# EAGLE schematic RFBoard (EAGLE 9.3.1)

## Sheet 1 of 8
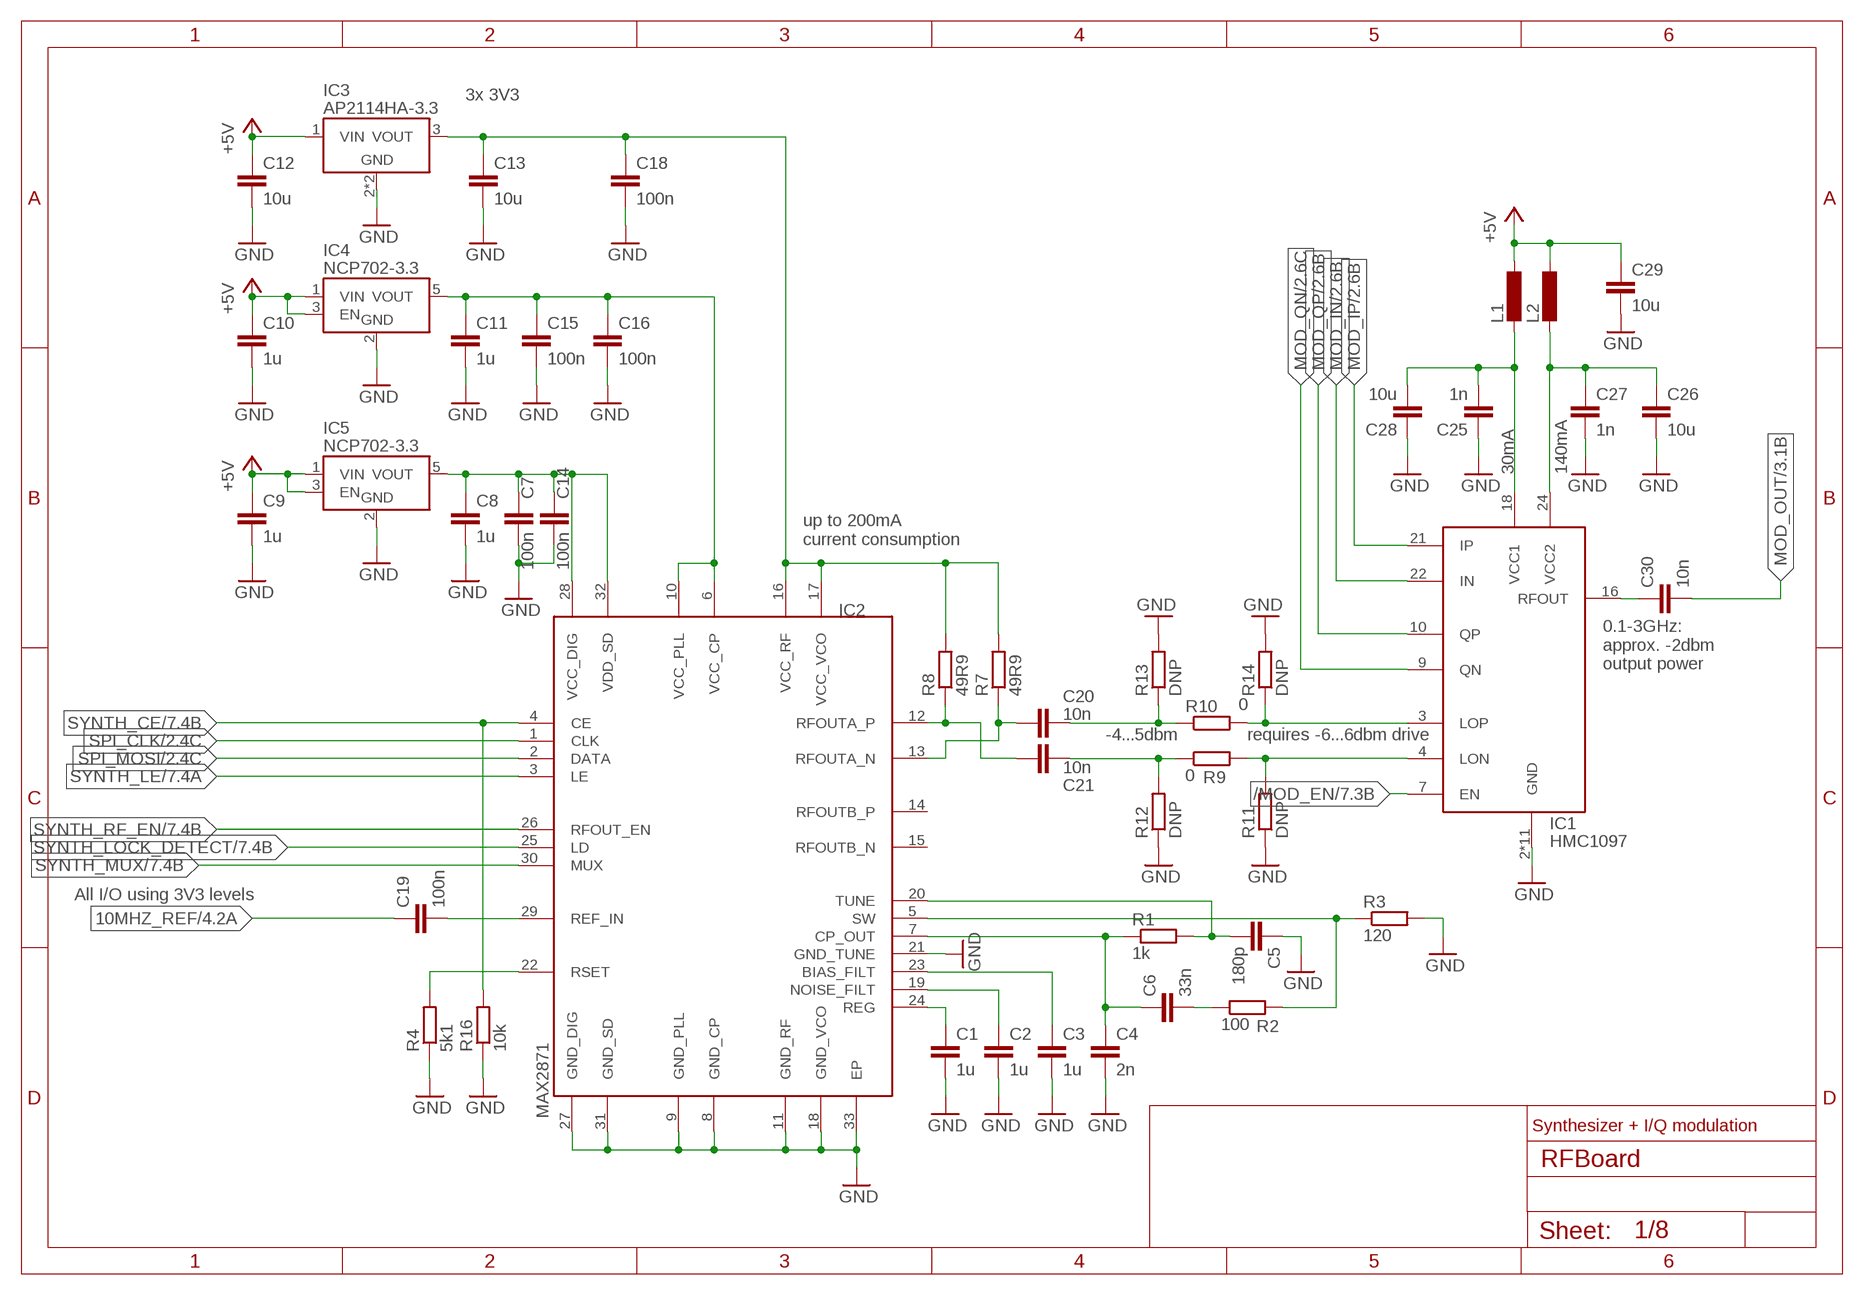
[diagram p0: schematic, sheet 1]

### Parts
C1  1u  C-EUC0603  [C0603]
C2  1u  C-EUC0603  [C0603]
C3  1u  C-EUC0603  [C0603]
C4  2n  C-EUC0603  [C0603]
C5  180p  C-EUC0603  [C0603]
C6  33n  C-EUC0603  [C0603]
C7  100n  C-EUC0603  [C0603]
C8  1u  C-EUC0603  [C0603]
C9  1u  C-EUC0603  [C0603]
C10  1u  C-EUC0603  [C0603]
C11  1u  C-EUC0603  [C0603]
C12  10u  C-EUC1206  [C1206]
C13  10u  C-EUC1206  [C1206]
C14  100n  C-EUC0603  [C0603]
C15  100n  C-EUC0603  [C0603]
C16  100n  C-EUC0603  [C0603]
C18  100n  C-EUC0603  [C0603]
C19  100n  C-EUC0603  [C0603]
C20  10n  C-EUC0603  [C0603]
C21  10n  C-EUC0603  [C0603]
C25  1n  C-EUC0603  [C0603]
C26  10u  C-EUC1206  [C1206]
C27  1n  C-EUC0603  [C0603]
C28  10u  C-EUC1206  [C1206]
C29  10u  C-EUC1206  [C1206]
C30  10n  C-EUC0603  [C0603]
IC1  HMC1097  [QFN50P400X400X100-25T280]
IC2  MAX2871  [QFN50P500X500X80-33T310]
IC3  AP2114HA-3.3  AP2114HA  [SOT230P700X180-4]
IC4  NCP702-3.3  NCP702  [SOT95P240X110-5]
IC5  NCP702-3.3  NCP702  [SOT95P240X110-5]
L1  L-EUL2012C  [L2012C]
L2  L-EUL2012C  [L2012C]
R1  1k  R-EU_R0603  [R0603]
R2  100  R-EU_R0603  [R0603]
R3  120  R-EU_R0603  [R0603]
R4  5k1  R-EU_R0603  [R0603]
R7  49R9  R-EU_R0603  [R0603]
R8  49R9  R-EU_R0603  [R0603]
R9  0  R-EU_R0603  [R0603]
R10  0  R-EU_R0603  [R0603]
R11  DNP  R-EU_R0603  [R0603]
R12  DNP  R-EU_R0603  [R0603]
R13  DNP  R-EU_R0603  [R0603]
R14  DNP  R-EU_R0603  [R0603]
R16  10k  R-EU_R0603  [R0603]

### Nets
10MHZ_REF: C19.1 ; also sheet 4,7
+5V: C9.1 C10.1 C12.1 C29.1 IC3.1(VIN) IC4.1(VIN) IC4.3(EN) IC5.1(VIN) IC5.3(EN) L1.1 L2.1 ; also sheet 2,3,4,5,6,7
/MOD_EN: IC1.7(EN) ; also sheet 7
GND: C1.2 C2.2 C3.2 C4.2 C5.1 C7.2 C8.2 C9.2 C10.2 C11.2 C12.2 C13.2 C14.2 C15.2 C16.2 C18.2 C25.1 C26.2 C27.2 C28.1 C29.2 IC1.2(GND) IC1.5(GND) IC1.8(GND) IC1.11(GND) IC1.12(GND) IC1.14(GND) IC1.17(GND) IC1.19(GND) IC1.20(GND) IC1.23(GND) IC1.25(GND) IC2.8(GND_CP) IC2.9(GND_PLL) IC2.11(GND_RF) IC2.18(GND_VCO) IC2.21(GND_TUNE) IC2.27(GND_DIG) IC2.31(GND_SD) IC2.33(EP) IC3.2(GND) IC3.4(GND) IC4.2(GND) IC5.2(GND) R3.2 R4.1 R11.1 R12.1 R13.2 R14.2 R16.1 ; also sheet 2,3,4,5,6,7,8
MOD_IN: IC1.22(IN) ; also sheet 2
MOD_IP: IC1.21(IP) ; also sheet 2
MOD_OUT: C30.2 ; also sheet 3
MOD_QN: IC1.9(QN) ; also sheet 2
MOD_QP: IC1.10(QP) ; also sheet 2
N$1: C5.2 IC2.20(TUNE) R1.2
N$2: C4.1 C6.1 IC2.7(CP_OUT) R1.1
N$3: C1.1 IC2.24(REG)
N$4: C2.1 IC2.19(NOISE_FILT)
N$5: C3.1 IC2.23(BIAS_FILT)
N$6: C6.2 R2.1
N$7: IC2.5(SW) R2.2 R3.1
N$8: IC2.22(RSET) R4.2
N$9: C19.2 IC2.29(REF_IN)
N$10: C13.1 C18.1 IC2.16(VCC_RF) IC2.17(VCC_VCO) IC3.3(VOUT) R7.2 R8.2
N$11: C11.1 C15.1 C16.1 IC2.6(VCC_CP) IC2.10(VCC_PLL) IC4.5(VOUT)
N$12: C20.1 IC2.13(RFOUTA_N) R7.1
N$13: C7.1 C8.1 C14.1 IC2.28(VCC_DIG) IC2.32(VDD_SD) IC5.5(VOUT)
N$14: C21.1 IC2.12(RFOUTA_P) R8.1
N$15: C20.2 R10.1 R13.1
N$16: C21.2 R9.1 R12.2
N$17: IC1.3(LOP) R10.2 R14.1
N$18: IC1.4(LON) R9.2 R11.2
N$20: C30.1 IC1.16(RFOUT)
SPI_CLK: IC2.1(CLK) ; also sheet 2,4,5,7
SPI_MOSI: IC2.2(DATA) ; also sheet 2,4,5,7
SYNTH_CE: IC2.4(CE) R16.2 ; also sheet 7
SYNTH_LE: IC2.3(LE) ; also sheet 7
SYNTH_LOCK_DETECT: IC2.25(LD) ; also sheet 7
SYNTH_MUX: IC2.30(MUX) ; also sheet 7
SYNTH_RF_EN: IC2.26(RFOUT_EN) ; also sheet 7
VDD: C25.2 C28.2 IC1.18(VCC1) L1.2
VDD1: C26.1 C27.1 IC1.24(VCC2) L2.2
Unconnected: IC2.14(RFOUTB_P) IC2.15(RFOUTB_N)

### Notes on the sheet
- 3x 3V3
- 30mA | 140mA
- up to 200mA
  current consumption
- 0.1-3GHz:
  approx. -2dbm
  output power
- -4...5dbm | requires -6...6dbm drive
- All I/O using 3V3 levels
- Synthesizer + I/Q modulation

## Sheet 2 of 8
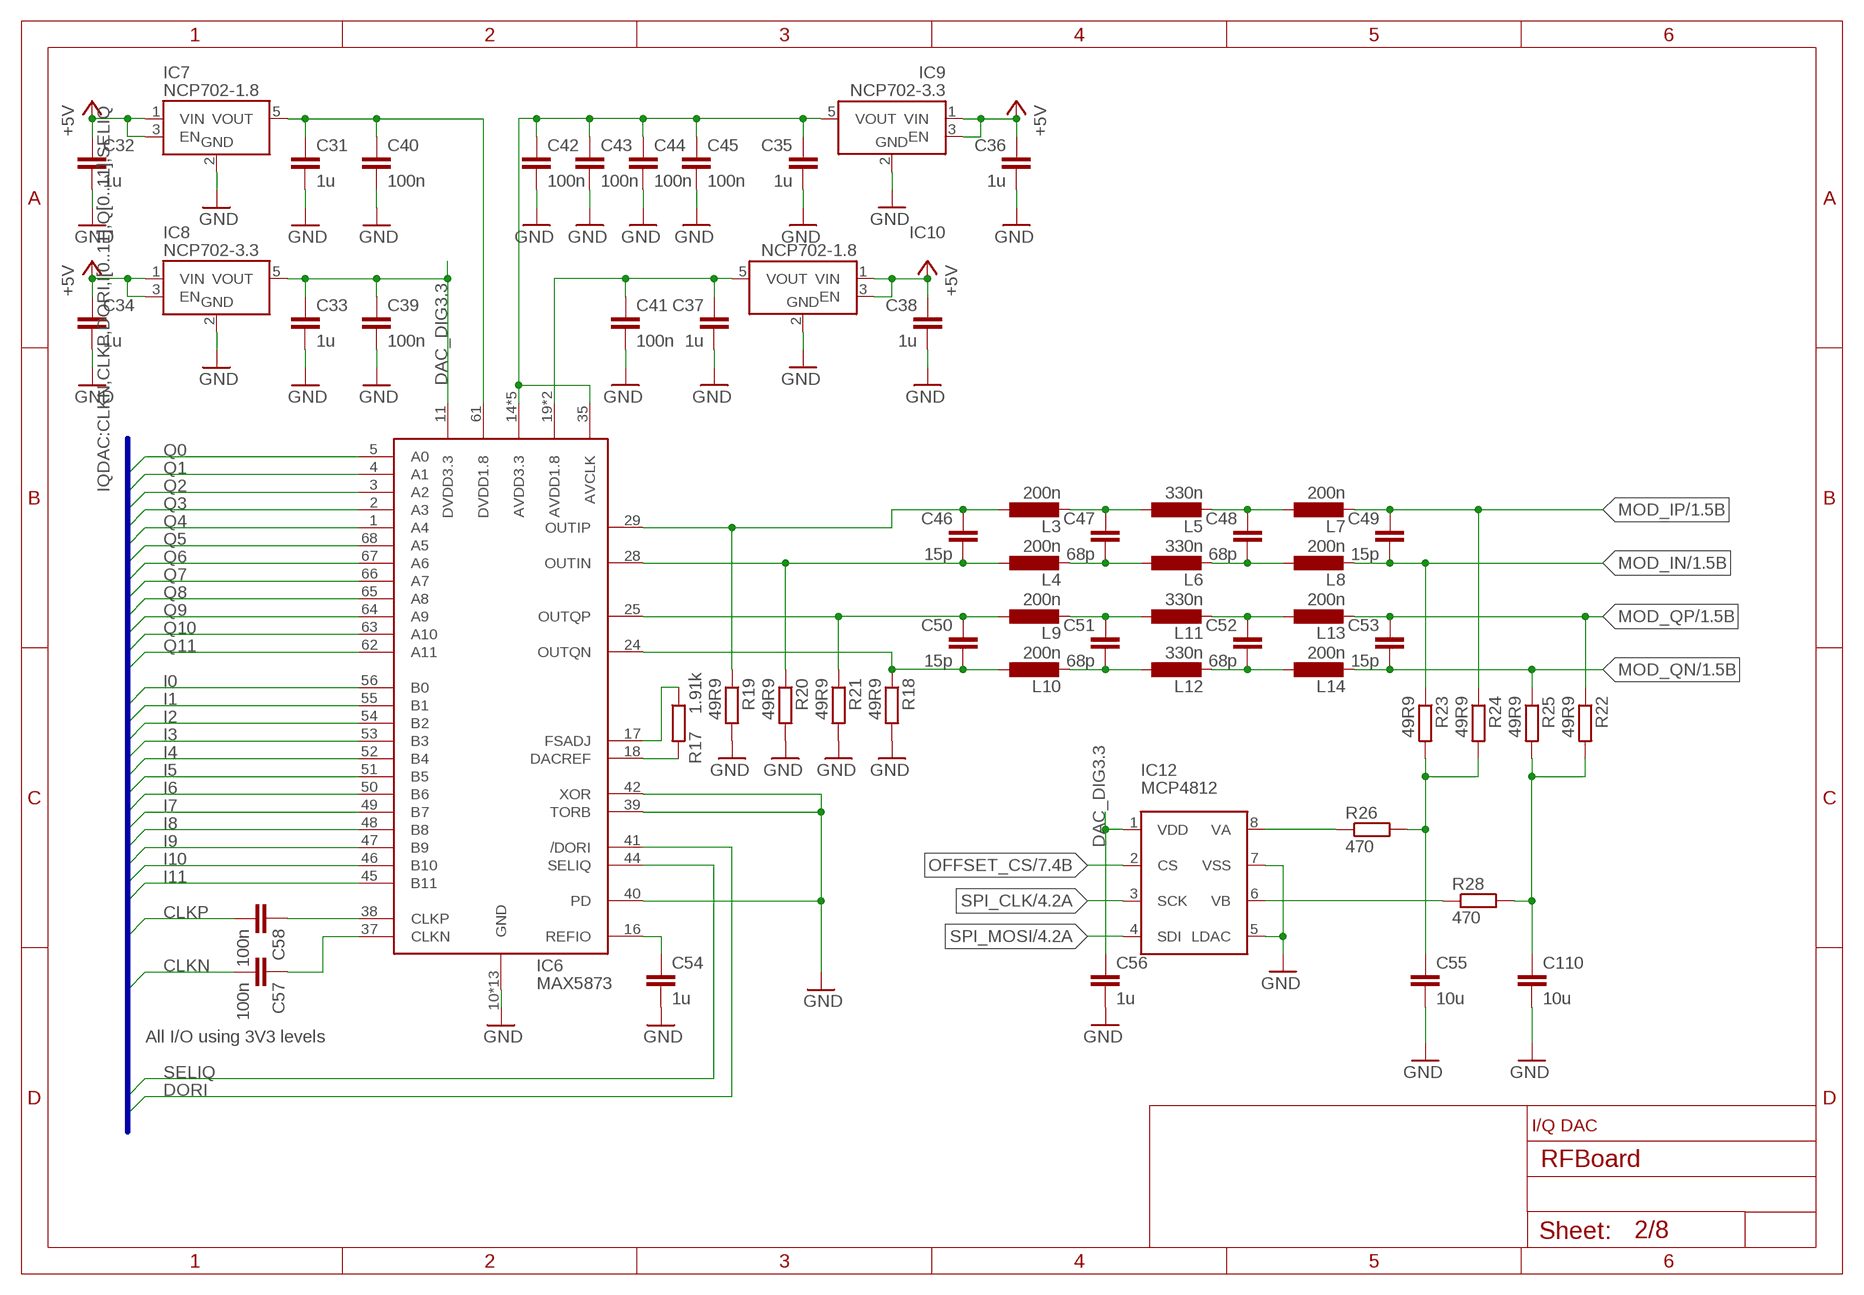
[diagram p1: schematic, sheet 2]

### Parts
C31  1u  C-EUC0603  [C0603]
C32  1u  C-EUC0603  [C0603]
C33  1u  C-EUC0603  [C0603]
C34  1u  C-EUC0603  [C0603]
C35  1u  C-EUC0603  [C0603]
C36  1u  C-EUC0603  [C0603]
C37  1u  C-EUC0603  [C0603]
C38  1u  C-EUC0603  [C0603]
C39  100n  C-EUC0603  [C0603]
C40  100n  C-EUC0603  [C0603]
C41  100n  C-EUC0603  [C0603]
C42  100n  C-EUC0603  [C0603]
C43  100n  C-EUC0603  [C0603]
C44  100n  C-EUC0603  [C0603]
C45  100n  C-EUC0603  [C0603]
C46  15p  C-EUC0603  [C0603]
C47  68p  C-EUC0603  [C0603]
C48  68p  C-EUC0603  [C0603]
C49  15p  C-EUC0603  [C0603]
C50  15p  C-EUC0603  [C0603]
C51  68p  C-EUC0603  [C0603]
C52  68p  C-EUC0603  [C0603]
C53  15p  C-EUC0603  [C0603]
C54  1u  C-EUC0603  [C0603]
C55  10u  C-EUC0603  [C0603]
C56  1u  C-EUC0603  [C0603]
C57  100n  C-EUC0603  [C0603]
C58  100n  C-EUC0603  [C0603]
C110  10u  C-EUC0603  [C0603]
IC6  MAX5873  [QFN50P1000X1000X100-69T770]
IC7  NCP702-1.8  NCP702  [SOT95P240X110-5]
IC8  NCP702-3.3  NCP702  [SOT95P240X110-5]
IC9  NCP702-3.3  NCP702  [SOT95P240X110-5]
IC10  NCP702-1.8  NCP702  [SOT95P240X110-5]
IC12  MCP4812  [SO08]
L3  200n  INDUCTOR0603  [R0603]
L4  200n  INDUCTOR0603  [R0603]
L5  330n  INDUCTOR0603  [R0603]
L6  330n  INDUCTOR0603  [R0603]
L7  200n  INDUCTOR0603  [R0603]
L8  200n  INDUCTOR0603  [R0603]
L9  200n  INDUCTOR0603  [R0603]
L10  200n  INDUCTOR0603  [R0603]
L11  330n  INDUCTOR0603  [R0603]
L12  330n  INDUCTOR0603  [R0603]
L13  200n  INDUCTOR0603  [R0603]
L14  200n  INDUCTOR0603  [R0603]
R17  1.91k  R-EU_R0603  [R0603]
R18  49R9  R-EU_R0603  [R0603]
R19  49R9  R-EU_R0603  [R0603]
R20  49R9  R-EU_R0603  [R0603]
R21  49R9  R-EU_R0603  [R0603]
R22  49R9  R-EU_R0603  [R0603]
R23  49R9  R-EU_R0603  [R0603]
R24  49R9  R-EU_R0603  [R0603]
R25  49R9  R-EU_R0603  [R0603]
R26  470  R-EU_R0603  [R0603]
R28  470  R-EU_R0603  [R0603]

### Nets
+5V: C32.1 C34.1 C36.1 C38.1 IC7.1(VIN) IC7.3(EN) IC8.1(VIN) IC8.3(EN) IC9.1(VIN) IC9.3(EN) IC10.1(VIN) IC10.3(EN) ; also sheet 1,3,4,5,6,7
CLKN: C57.2 ; also sheet 7
CLKP: C58.2 ; also sheet 7
DAC_DIG3.3: C33.1 C39.1 C56.1 IC6.11(DVDD3.3) IC8.5(VOUT) IC12.1(VDD)
DORI: IC6.41(/DORI) ; also sheet 7
GND: C31.2 C32.2 C33.2 C34.2 C35.2 C36.2 C37.2 C38.2 C39.2 C40.2 C41.2 C42.2 C43.2 C44.2 C45.2 C54.2 C55.2 C56.2 C110.2 IC6.10(GND) IC6.12(GND) IC6.13(GND) IC6.15(GND) IC6.20(GND) IC6.23(GND) IC6.26(GND) IC6.27(GND) IC6.30(GND) IC6.33(GND) IC6.36(GND) IC6.39(TORB) IC6.40(PD) IC6.42(XOR) IC6.43(GND) IC6.69(GND) IC7.2(GND) IC8.2(GND) IC9.2(GND) IC10.2(GND) IC12.5(LDAC) IC12.7(VSS) R18.2 R19.2 R20.2 R21.2 ; also sheet 1,3,4,5,6,7,8
I0: IC6.56(B0) ; also sheet 7
I1: IC6.55(B1) ; also sheet 7
I2: IC6.54(B2) ; also sheet 7
I3: IC6.53(B3) ; also sheet 7
I4: IC6.52(B4) ; also sheet 7
I5: IC6.51(B5) ; also sheet 7
I6: IC6.50(B6) ; also sheet 7
I7: IC6.49(B7) ; also sheet 7
I8: IC6.48(B8) ; also sheet 7
I9: IC6.47(B9) ; also sheet 7
I10: IC6.46(B10) ; also sheet 7
I11: IC6.45(B11) ; also sheet 7
MOD_IN: C49.2 L8.2 R23.1 ; also sheet 1
MOD_IP: C49.1 L7.2 R24.1 ; also sheet 1
MOD_QN: C53.2 L14.2 R25.1 ; also sheet 1
MOD_QP: C53.1 L13.2 R22.1 ; also sheet 1
N$22: C31.1 C40.1 IC6.61(DVDD1.8) IC7.5(VOUT)
N$23: C58.1 IC6.38(CLKP)
N$25: C35.1 C42.1 C43.1 C44.1 C45.1 IC6.14(AVDD3.3) IC6.21(AVDD3.3) IC6.22(AVDD3.3) IC6.31(AVDD3.3) IC6.32(AVDD3.3) IC6.35(AVCLK) IC9.5(VOUT)
N$26: C37.1 C41.1 IC6.19(AVDD1.8) IC6.34(AVDD1.8) IC10.5(VOUT)
N$27: IC6.18(DACREF) R17.2
N$28: IC6.17(FSADJ) R17.1
N$29: C55.1 R23.2 R24.2 R26.2
N$30: C110.1 R22.2 R25.2 R28.2
N$31: C46.2 IC6.28(OUTIN) L4.1 R20.1
N$32: C46.1 IC6.29(OUTIP) L3.1 R19.1
N$33: C47.2 L4.2 L6.1
N$34: C48.2 L6.2 L8.1
N$35: C47.1 L3.2 L5.1
N$36: C48.1 L5.2 L7.1
N$37: C54.1 IC6.16(REFIO)
N$38: IC12.8(VA) R26.1
N$39: C50.2 IC6.24(OUTQN) L10.1 R18.1
N$40: C50.1 IC6.25(OUTQP) L9.1 R21.1
N$41: C51.2 L10.2 L12.1
N$42: C52.2 L12.2 L14.1
N$43: C51.1 L9.2 L11.1
N$44: C52.1 L11.2 L13.1
N$45: C57.1 IC6.37(CLKN)
N$103: IC12.6(VB) R28.1
OFFSET_CS: IC12.2(CS) ; also sheet 7
Q0: IC6.5(A0) ; also sheet 7
Q1: IC6.4(A1) ; also sheet 7
Q2: IC6.3(A2) ; also sheet 7
Q3: IC6.2(A3) ; also sheet 7
Q4: IC6.1(A4) ; also sheet 7
Q5: IC6.68(A5) ; also sheet 7
Q6: IC6.67(A6) ; also sheet 7
Q7: IC6.66(A7) ; also sheet 7
Q8: IC6.65(A8) ; also sheet 7
Q9: IC6.64(A9) ; also sheet 7
Q10: IC6.63(A10) ; also sheet 7
Q11: IC6.62(A11) ; also sheet 7
SELIQ: IC6.44(SELIQ) ; also sheet 7
SPI_CLK: IC12.3(SCK) ; also sheet 1,4,5,7
SPI_MOSI: IC12.4(SDI) ; also sheet 1,4,5,7

### Buses
IQDAC:CLKN,CLKP,DORI,I[0..11],Q[0..11],SELIQ

### Notes on the sheet
- All I/O using 3V3 levels
- I/Q DAC

## Sheet 3 of 8
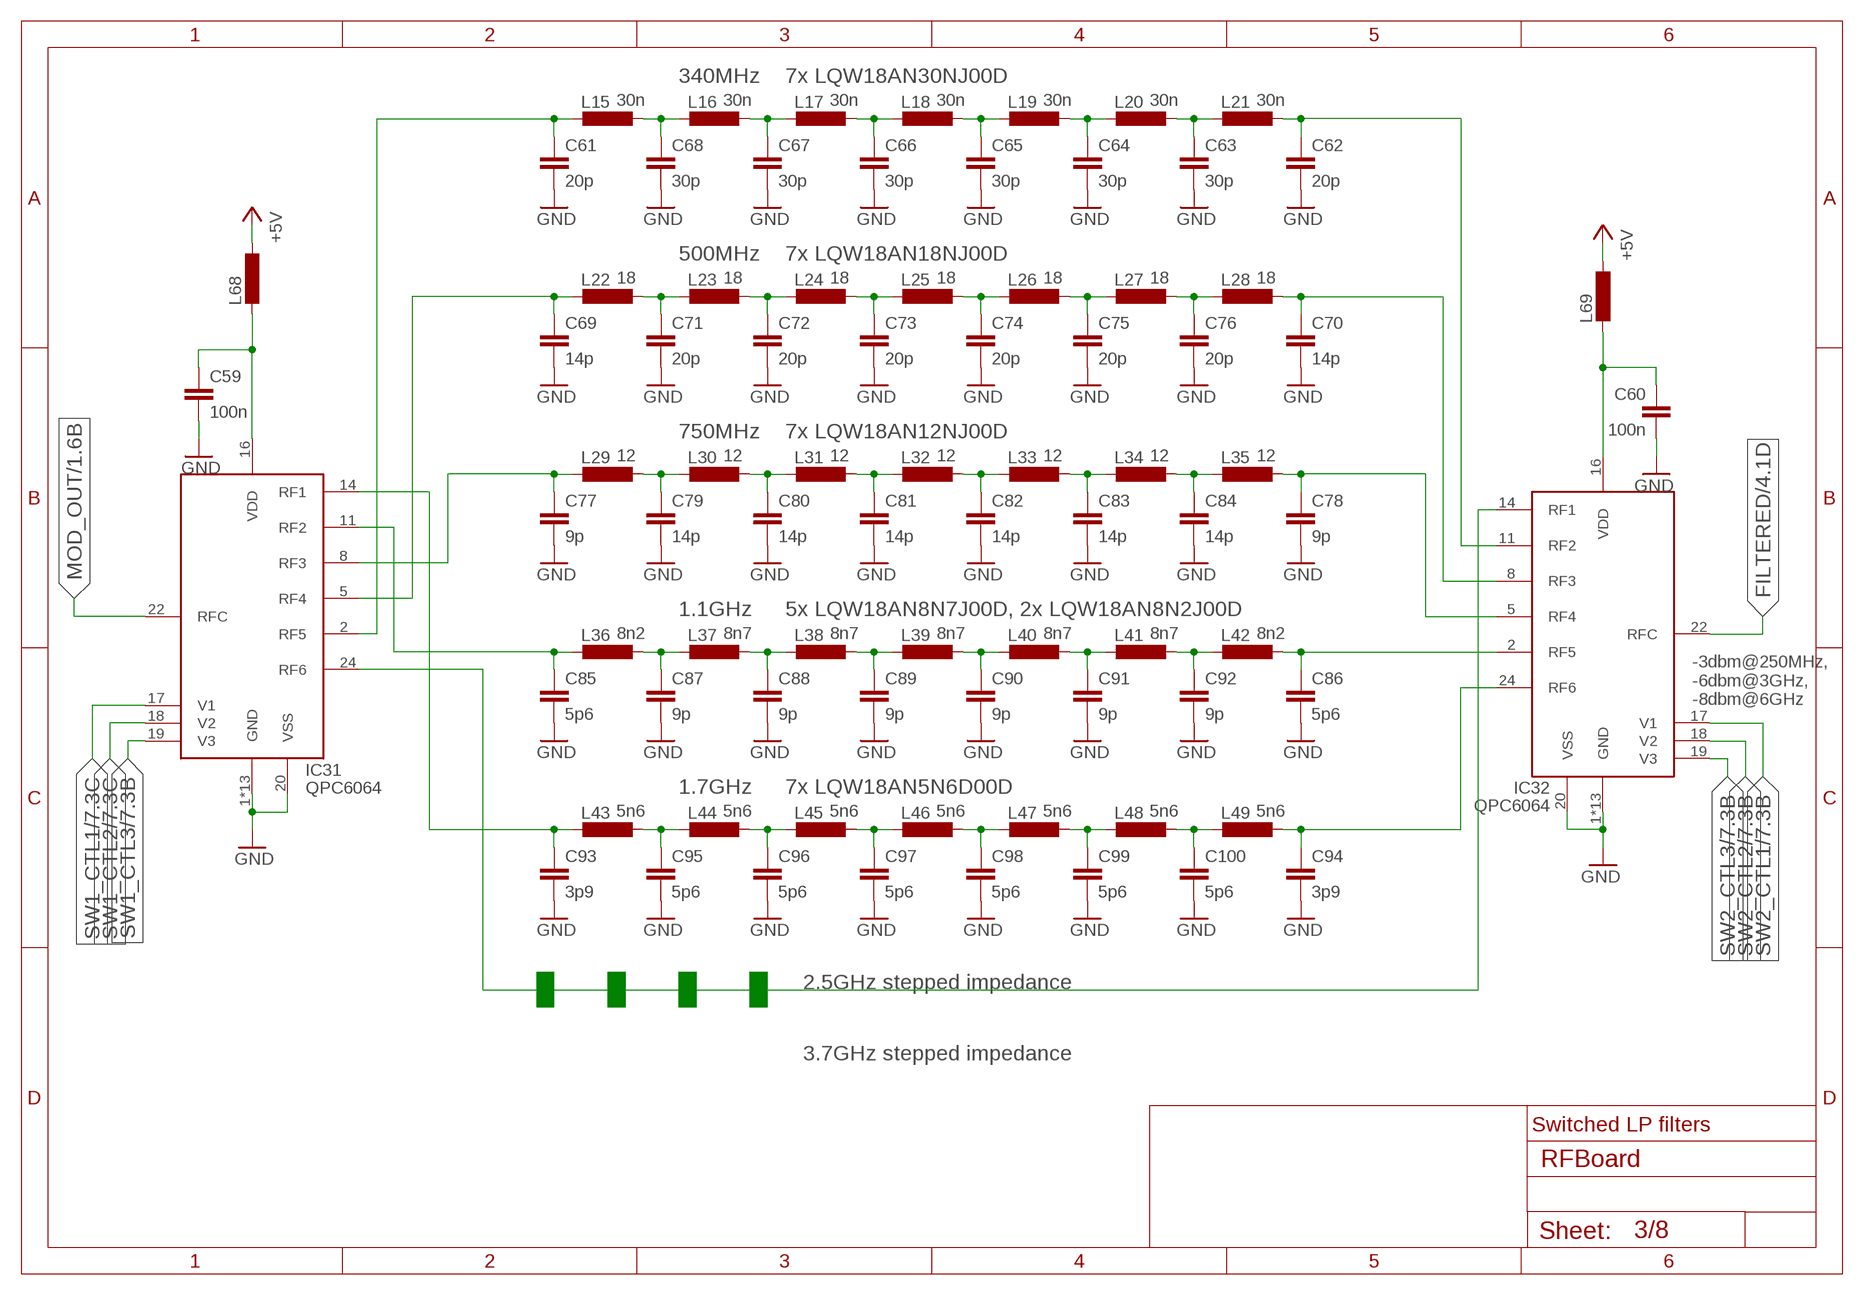
[diagram p2: schematic, sheet 3]

### Parts
C59  100n  C-EUC0603  [C0603]
C60  100n  C-EUC0603  [C0603]
C61  20p  C-EUC0603  [C0603]
C62  20p  C-EUC0603  [C0603]
C63  30p  C-EUC0603  [C0603]
C64  30p  C-EUC0603  [C0603]
C65  30p  C-EUC0603  [C0603]
C66  30p  C-EUC0603  [C0603]
C67  30p  C-EUC0603  [C0603]
C68  30p  C-EUC0603  [C0603]
C69  14p  C-EUC0603  [C0603]
C70  14p  C-EUC0603  [C0603]
C71  20p  C-EUC0603  [C0603]
C72  20p  C-EUC0603  [C0603]
C73  20p  C-EUC0603  [C0603]
C74  20p  C-EUC0603  [C0603]
C75  20p  C-EUC0603  [C0603]
C76  20p  C-EUC0603  [C0603]
C77  9p  C-EUC0603  [C0603]
C78  9p  C-EUC0603  [C0603]
C79  14p  C-EUC0603  [C0603]
C80  14p  C-EUC0603  [C0603]
C81  14p  C-EUC0603  [C0603]
C82  14p  C-EUC0603  [C0603]
C83  14p  C-EUC0603  [C0603]
C84  14p  C-EUC0603  [C0603]
C85  5p6  C-EUC0603  [C0603]
C86  5p6  C-EUC0603  [C0603]
C87  9p  C-EUC0603  [C0603]
C88  9p  C-EUC0603  [C0603]
C89  9p  C-EUC0603  [C0603]
C90  9p  C-EUC0603  [C0603]
C91  9p  C-EUC0603  [C0603]
C92  9p  C-EUC0603  [C0603]
C93  3p9  C-EUC0603  [C0603]
C94  3p9  C-EUC0603  [C0603]
C95  5p6  C-EUC0603  [C0603]
C96  5p6  C-EUC0603  [C0603]
C97  5p6  C-EUC0603  [C0603]
C98  5p6  C-EUC0603  [C0603]
C99  5p6  C-EUC0603  [C0603]
C100  5p6  C-EUC0603  [C0603]
IC31  QPC6064  [QFN50P400X400X75-25T270]
IC32  QPC6064  [QFN50P400X400X75-25T270]
L15  30n  INDUCTOR0603  [R0603]
L16  30n  INDUCTOR0603  [R0603]
L17  30n  INDUCTOR0603  [R0603]
L18  30n  INDUCTOR0603  [R0603]
L19  30n  INDUCTOR0603  [R0603]
L20  30n  INDUCTOR0603  [R0603]
L21  30n  INDUCTOR0603  [R0603]
L22  18  INDUCTOR0603  [R0603]
L23  18  INDUCTOR0603  [R0603]
L24  18  INDUCTOR0603  [R0603]
L25  18  INDUCTOR0603  [R0603]
L26  18  INDUCTOR0603  [R0603]
L27  18  INDUCTOR0603  [R0603]
L28  18  INDUCTOR0603  [R0603]
L29  12  INDUCTOR0603  [R0603]
L30  12  INDUCTOR0603  [R0603]
L31  12  INDUCTOR0603  [R0603]
L32  12  INDUCTOR0603  [R0603]
L33  12  INDUCTOR0603  [R0603]
L34  12  INDUCTOR0603  [R0603]
L35  12  INDUCTOR0603  [R0603]
L36  8n2  INDUCTOR0603  [R0603]
L37  8n7  INDUCTOR0603  [R0603]
L38  8n7  INDUCTOR0603  [R0603]
L39  8n7  INDUCTOR0603  [R0603]
L40  8n7  INDUCTOR0603  [R0603]
L41  8n7  INDUCTOR0603  [R0603]
L42  8n2  INDUCTOR0603  [R0603]
L43  5n6  INDUCTOR0603  [R0603]
L44  5n6  INDUCTOR0603  [R0603]
L45  5n6  INDUCTOR0603  [R0603]
L46  5n6  INDUCTOR0603  [R0603]
L47  5n6  INDUCTOR0603  [R0603]
L48  5n6  INDUCTOR0603  [R0603]
L49  5n6  INDUCTOR0603  [R0603]
L68  L-EUL2012C  [L2012C]
L69  L-EUL2012C  [L2012C]

### Nets
+5V: L68.1 L69.1 ; also sheet 1,2,4,5,6,7
FILTERED: IC32.22(RFC) ; also sheet 4
GND: C59.2 C60.2 C61.2 C62.2 C63.2 C64.2 C65.2 C66.2 C67.2 C68.2 C69.2 C70.2 C71.2 C72.2 C73.2 C74.2 C75.2 C76.2 C77.2 C78.2 C79.2 C80.2 C81.2 C82.2 C83.2 C84.2 C85.2 C86.2 C87.2 C88.2 C89.2 C90.2 C91.2 C92.2 C93.2 C94.2 C95.2 C96.2 C97.2 C98.2 C99.2 C100.2 IC31.1(GND) IC31.3(GND) IC31.4(GND) IC31.6(GND) IC31.7(GND) IC31.9(GND) IC31.10(GND) IC31.12(GND) IC31.13(GND) IC31.15(GND) IC31.20(VSS) IC31.21(GND) IC31.23(GND) IC31.25(GND) IC32.1(GND) IC32.3(GND) IC32.4(GND) IC32.6(GND) IC32.7(GND) IC32.9(GND) IC32.10(GND) IC32.12(GND) IC32.13(GND) IC32.15(GND) IC32.20(VSS) IC32.21(GND) IC32.23(GND) IC32.25(GND) ; also sheet 1,2,4,5,6,7,8
MOD_OUT: IC31.22(RFC) ; also sheet 1
N$46: C68.1 L15.1 L16.2
N$47: C67.1 L16.1 L17.2
N$48: C66.1 L17.1 L18.2
N$49: C65.1 L18.1 L19.2
N$50: C64.1 L19.1 L20.2
N$51: C63.1 L20.1 L21.2
N$52: C61.1 IC31.2(RF5) L15.2
N$53: C62.1 IC32.11(RF2) L21.1
N$54: C71.1 L22.1 L23.2
N$55: C72.1 L23.1 L24.2
N$56: C73.1 L24.1 L25.2
N$57: C74.1 L25.1 L26.2
N$58: C75.1 L26.1 L27.2
N$59: C76.1 L27.1 L28.2
N$60: C69.1 IC31.5(RF4) L22.2
N$62: C79.1 L29.1 L30.2
N$63: C80.1 L30.1 L31.2
N$64: C81.1 L31.1 L32.2
N$65: C82.1 L32.1 L33.2
N$66: C83.1 L33.1 L34.2
N$67: C84.1 L34.1 L35.2
N$69: C78.1 IC32.5(RF4) L35.1
N$70: C87.1 L36.1 L37.2
N$71: C88.1 L37.1 L38.2
N$72: C89.1 L38.1 L39.2
N$73: C90.1 L39.1 L40.2
N$74: C91.1 L40.1 L41.2
N$75: C92.1 L41.1 L42.2
N$76: C85.1 IC31.11(RF2) L36.2
N$77: C86.1 IC32.2(RF5) L42.1
N$78: C95.1 L43.1 L44.2
N$79: C96.1 L44.1 L45.2
N$80: C97.1 L45.1 L46.2
N$81: C98.1 L46.1 L47.2
N$82: C99.1 L47.1 L48.2
N$83: C100.1 L48.1 L49.2
N$84: C93.1 IC31.14(RF1) L43.2
N$85: C94.1 IC32.24(RF6) L49.1
N$90: C77.1 IC31.8(RF3) L29.2
N$91: C70.1 IC32.8(RF3) L28.1
STEPPED25: IC31.24(RF6) IC32.14(RF1)
SW1_CTL1: IC31.17(V1) ; also sheet 7
SW1_CTL2: IC31.18(V2) ; also sheet 7
SW1_CTL3: IC31.19(V3) ; also sheet 7
SW2_CTL1: IC32.17(V1) ; also sheet 7
SW2_CTL2: IC32.18(V2) ; also sheet 7
SW2_CTL3: IC32.19(V3) ; also sheet 7
SWITCHES_VCC: C60.1 IC32.16(VDD) L69.2
VDD2: C59.1 IC31.16(VDD) L68.2

### Notes on the sheet
- 340MHz | 7x LQW18AN30NJ00D
- 500MHz | 7x LQW18AN18NJ00D
- 750MHz | 7x LQW18AN12NJ00D
- 1.1GHz | 5x LQW18AN8N7J00D, 2x LQW18AN8N2J00D
- -3dbm@250MHz,
  -6dbm@3GHz,
  -8dbm@6GHz
- 1.7GHz | 7x LQW18AN5N6D00D
- 2.5GHz stepped impedance
- 3.7GHz stepped impedance
- Switched LP filters

## Sheet 4 of 8
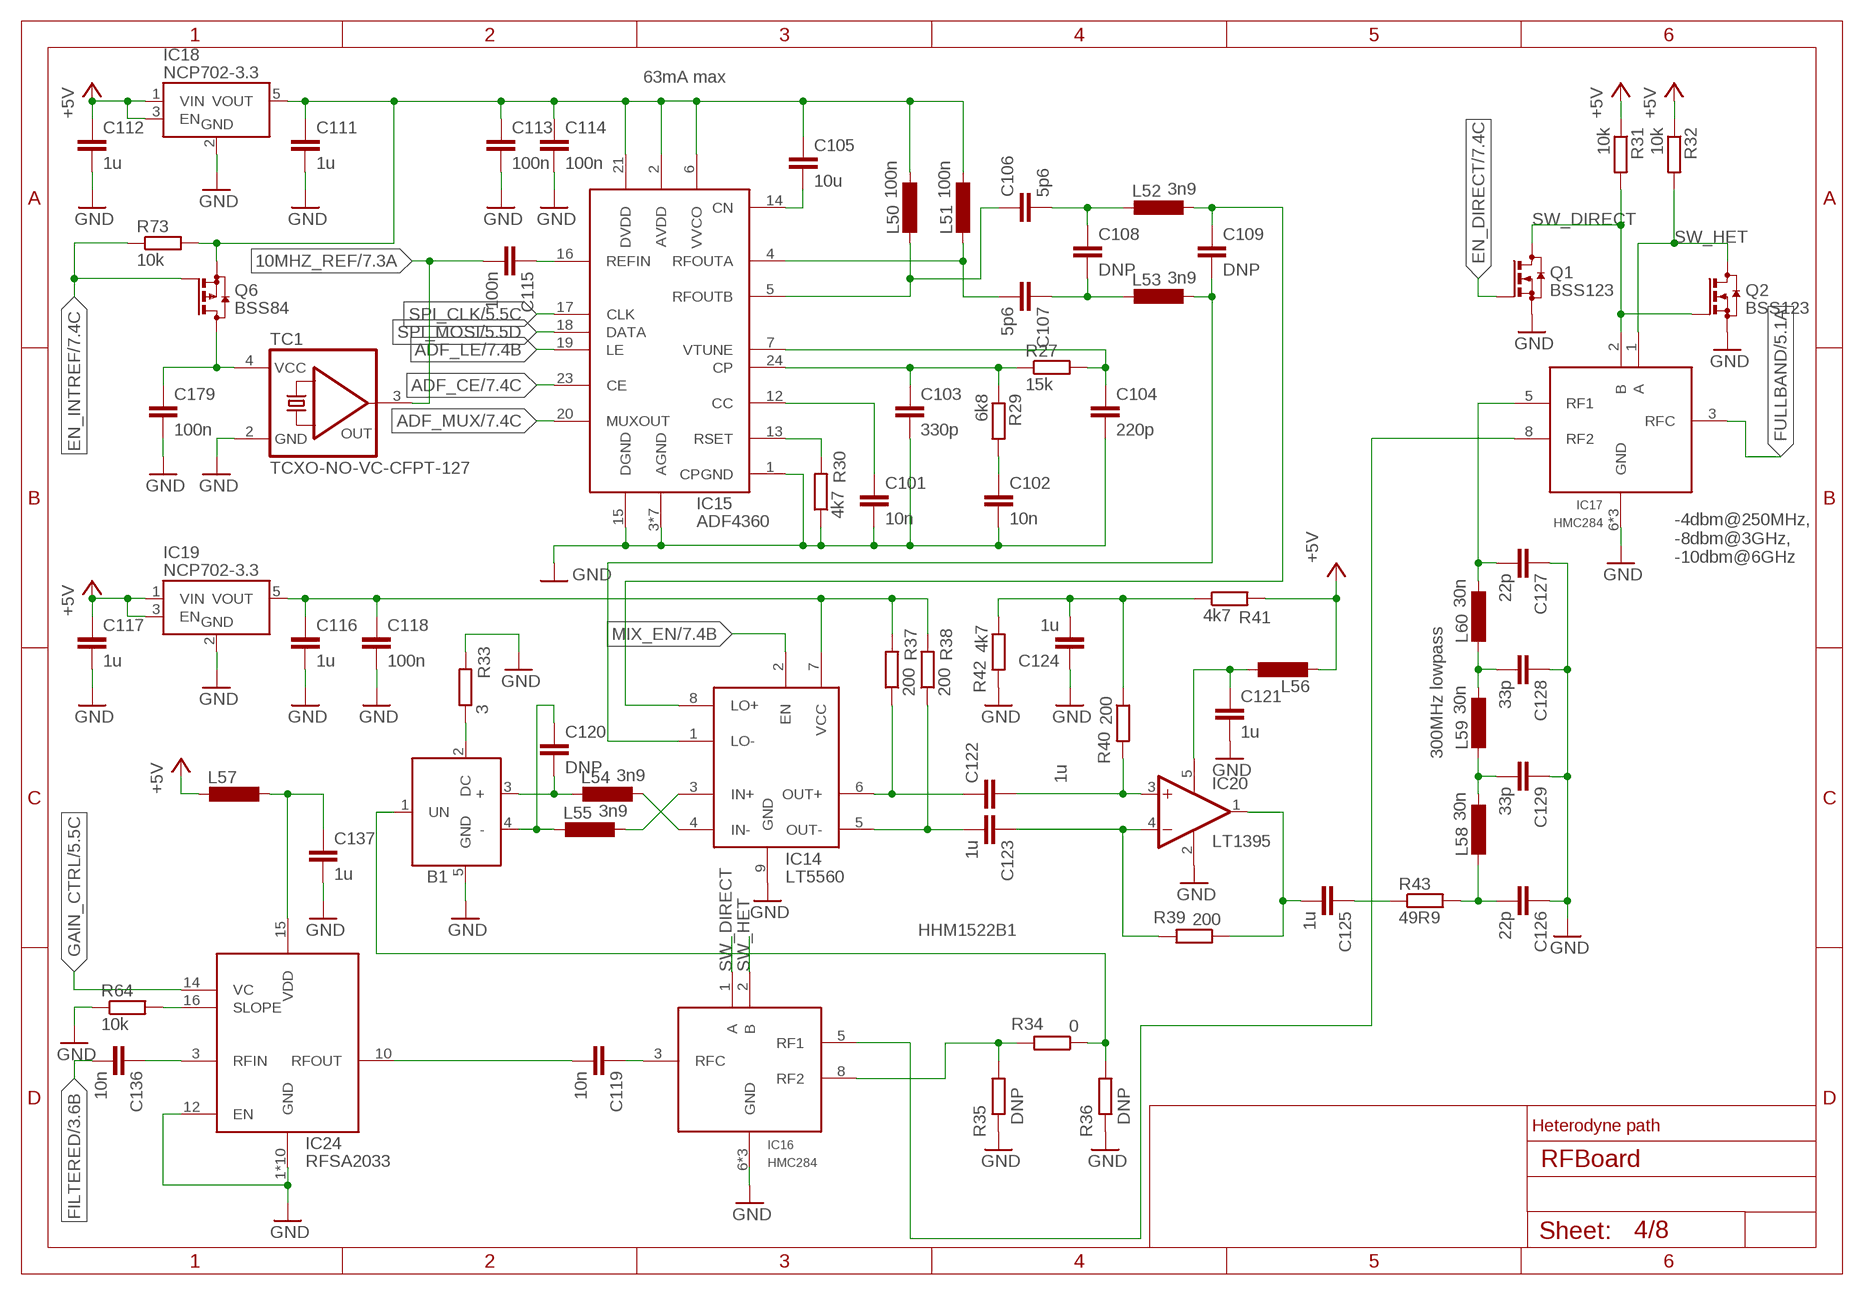
[diagram p3: schematic, sheet 4]

### Parts
B1  HHM1522B1  [INDCAF65P200X125X95-6]
C101  10n  C-EUC0603  [C0603]
C102  10n  C-EUC0603  [C0603]
C103  330p  C-EUC0603  [C0603]
C104  220p  C-EUC0603  [C0603]
C105  10u  C-EUC0603  [C0603]
C106  5p6  C-EUC0603  [C0603]
C107  5p6  C-EUC0603  [C0603]
C108  DNP  C-EUC0603  [C0603]
C109  DNP  C-EUC0603  [C0603]
C111  1u  C-EUC0603  [C0603]
C112  1u  C-EUC0603  [C0603]
C113  100n  C-EUC0603  [C0603]
C114  100n  C-EUC0603  [C0603]
C115  100n  C-EUC0603  [C0603]
C116  1u  C-EUC0603  [C0603]
C117  1u  C-EUC0603  [C0603]
C118  100n  C-EUC0603  [C0603]
C119  10n  C-EUC0603  [C0603]
C120  DNP  C-EUC0603  [C0603]
C121  1u  C-EUC0603  [C0603]
C122  1u  C-EUC0603  [C0603]
C123  1u  C-EUC0603  [C0603]
C124  1u  C-EUC0603  [C0603]
C125  1u  C-EUC0603  [C0603]
C126  22p  C-EUC0603  [C0603]
C127  22p  C-EUC0603  [C0603]
C128  33p  C-EUC0603  [C0603]
C129  33p  C-EUC0603  [C0603]
C136  10n  C-EUC0603  [C0603]
C137  1u  C-EUC0603  [C0603]
C179  100n  C-EUC0603  [C0603]
IC14  LT5560  [SON50P300X300X80-9T165X238]
IC15  ADF4360  [QFN50P400X400X80-25T230]
IC16  HMC284  [MSOP08]
IC17  HMC284  [MSOP08]
IC18  NCP702-3.3  NCP702  [SOT95P240X110-5]
IC19  NCP702-3.3  NCP702  [SOT95P240X110-5]
IC20  LT1395  OPA344N-SOT23  [SOT23-5]
IC24  RFSA2033  [QFN50P300X300X85-17T170]
L50  100n  INDUCTOR0603  [R0603]
L51  100n  INDUCTOR0603  [R0603]
L52  3n9  INDUCTOR0603  [R0603]
L53  3n9  INDUCTOR0603  [R0603]
L54  3n9  INDUCTOR0603  [R0603]
L55  3n9  INDUCTOR0603  [R0603]
L56  L-EUL2012C  [L2012C]
L57  L-EUL2012C  [L2012C]
L58  30n  INDUCTOR0603  [R0603]
L59  30n  INDUCTOR0603  [R0603]
L60  30n  INDUCTOR0603  [R0603]
Q1  BSS123  [SOT23]
Q2  BSS123  [SOT23]
Q6  BSS84  [SOT23]
R27  15k  R-EU_R0603  [R0603]
R29  6k8  R-EU_R0603  [R0603]
R30  4k7  R-EU_R0603  [R0603]
R31  10k  R-EU_R0603  [R0603]
R32  10k  R-EU_R0603  [R0603]
R33  3  R-EU_R0603  [R0603]
R34  0  R-EU_R0603  [R0603]
R35  DNP  R-EU_R0603  [R0603]
R36  DNP  R-EU_R0603  [R0603]
R37  200  R-EU_R0603  [R0603]
R38  200  R-EU_R0603  [R0603]
R39  200  R-EU_R0603  [R0603]
R40  200  R-EU_R0603  [R0603]
R41  4k7  R-EU_R0603  [R0603]
R42  4k7  R-EU_R0603  [R0603]
R43  49R9  R-EU_R0603  [R0603]
R64  10k  R-EU_R0603  [R0603]
R73  10k  R-EU_R0603  [R0603]
TC1  TCXO-NO-VC-CFPT-127  [5.0X3.2-TCXO]

### Nets
10MHZ_REF: C115.2 TC1.3(OUT) ; also sheet 1,7
+5V: C112.1 C117.1 IC18.1(VIN) IC18.3(EN) IC19.1(VIN) IC19.3(EN) L56.2 L57.2 R31.1 R32.1 R41.2 ; also sheet 1,2,3,5,6,7
ADF_CE: IC15.23(CE) ; also sheet 7
ADF_LE: IC15.19(LE) ; also sheet 7
ADF_MUX: IC15.20(MUXOUT) ; also sheet 7
DAC_DIG3.2: C116.1 C118.1 IC14.7(VCC) IC19.5(VOUT) R37.2 R38.2
EN_DIRECT: Q1.1(G) ; also sheet 7
EN_INTREF: Q6.1(G) R73.1 ; also sheet 7
FILTERED: C136.2 ; also sheet 3
FULLBAND: IC17.3(RFC) ; also sheet 5
GAIN_CTRL: IC24.14(VC) ; also sheet 5
GND: B1.5(GND) C101.2 C102.2 C103.2 C104.2 C111.2 C112.2 C113.2 C114.2 C116.2 C117.2 C118.2 C121.2 C124.1 C126.1 C127.1 C128.1 C129.1 C137.2 C179.2 IC14.9(GND) IC15.1(CPGND) IC15.3(AGND) IC15.8(AGND) IC15.9(AGND) IC15.10(AGND) IC15.11(AGND) IC15.15(DGND) IC15.22(AGND) IC15.25(AGND) IC16.6(GND) IC16.7(GND) IC16.9(GND) IC17.6(GND) IC17.7(GND) IC17.9(GND) IC18.2(GND) IC19.2(GND) IC20.2(V-) IC24.1(GND) IC24.2(GND) IC24.4(GND) IC24.5(GND) IC24.6(GND) IC24.7(GND) IC24.8(GND) IC24.9(GND) IC24.11(GND) IC24.12(EN) IC24.17(GND) Q1.2(S) Q2.2(S) R30.1 R33.2 R35.2 R36.2 R42.2 R64.1 TC1.2(GND) ; also sheet 1,2,3,5,6,7,8
MIX_EN: IC14.2(EN) ; also sheet 7
N$61: IC14.3(IN+) L55.1
N$68: IC14.4(IN-) L54.1
N$86: IC15.13(RSET) R30.2
N$87: C101.1 IC15.12(CC)
N$88: C102.1 R29.2
N$92: C103.1 IC15.24(CP) R27.1 R29.1
N$93: C104.1 IC15.7(VTUNE) R27.2
N$94: C115.1 IC15.16(REFIN)
N$95: C105.2 IC15.14(CN)
N$96: C106.1 IC15.5(RFOUTB) L50.2
N$97: C107.2 IC15.4(RFOUTA) L51.2
N$98: C106.2 C108.1 L52.2
N$99: C107.1 C108.2 L53.2
N$100: C109.1 IC14.8(LO+) L52.1
N$101: C109.2 IC14.1(LO-) L53.1
N$102: C119.1 IC16.3(RFC)
N$104: B1.3(+) C120.2 L54.2
N$107: B1.4(-) C120.1 L55.2
N$108: IC16.5(RF1) IC17.8(RF2)
N$109: IC16.8(RF2) R34.2 R35.1
N$110: B1.2(DC) R33.1
N$111: B1.1(UN) R34.1 R36.1
N$112: C121.1 IC20.5(V+) L56.1
N$113: C122.1 IC14.6(OUT+) R37.1
N$114: C123.2 IC14.5(OUT-) R38.1
N$115: C125.2 IC20.1(OUT) R39.1
N$116: C123.1 IC20.4(-IN) R39.2
N$117: C122.2 IC20.3(+IN) R40.2
N$118: C124.2 R40.1 R41.1 R42.1
N$119: C125.1 R43.1
N$120: C127.2 IC17.5(RF1) L60.1
N$121: C126.2 L58.2 R43.2
N$122: C129.2 L58.1 L59.2
N$123: C128.2 L59.1 L60.2
N$135: C119.2 IC24.10(RFOUT)
N$136: C136.1 IC24.3(RFIN)
N$137: C137.1 IC24.15(VDD) L57.1
N$164: IC24.16(SLOPE) R64.2
N$181: C179.1 Q6.3(D) TC1.4(VCC)
PLL_DIG3: C105.1 C111.1 C113.1 C114.1 IC15.2(AVDD) IC15.6(VVCO) IC15.21(DVDD) IC18.5(VOUT) L50.1 L51.1 Q6.2(S) R73.2
SPI_CLK: IC15.17(CLK) ; also sheet 1,2,5,7
SPI_MOSI: IC15.18(DATA) ; also sheet 1,2,5,7
SW_DIRECT: IC16.1(A) IC17.2(B) Q1.3(D) Q2.1(G) R31.2
SW_HET: IC16.2(B) IC17.1(A) Q2.3(D) R32.2

### Notes on the sheet
- 63mA max
- -4dbm@250MHz,
  -8dbm@3GHz,
  -10dbm@6GHz
- 300MHz lowpass
- Heterodyne path

## Sheet 5 of 8
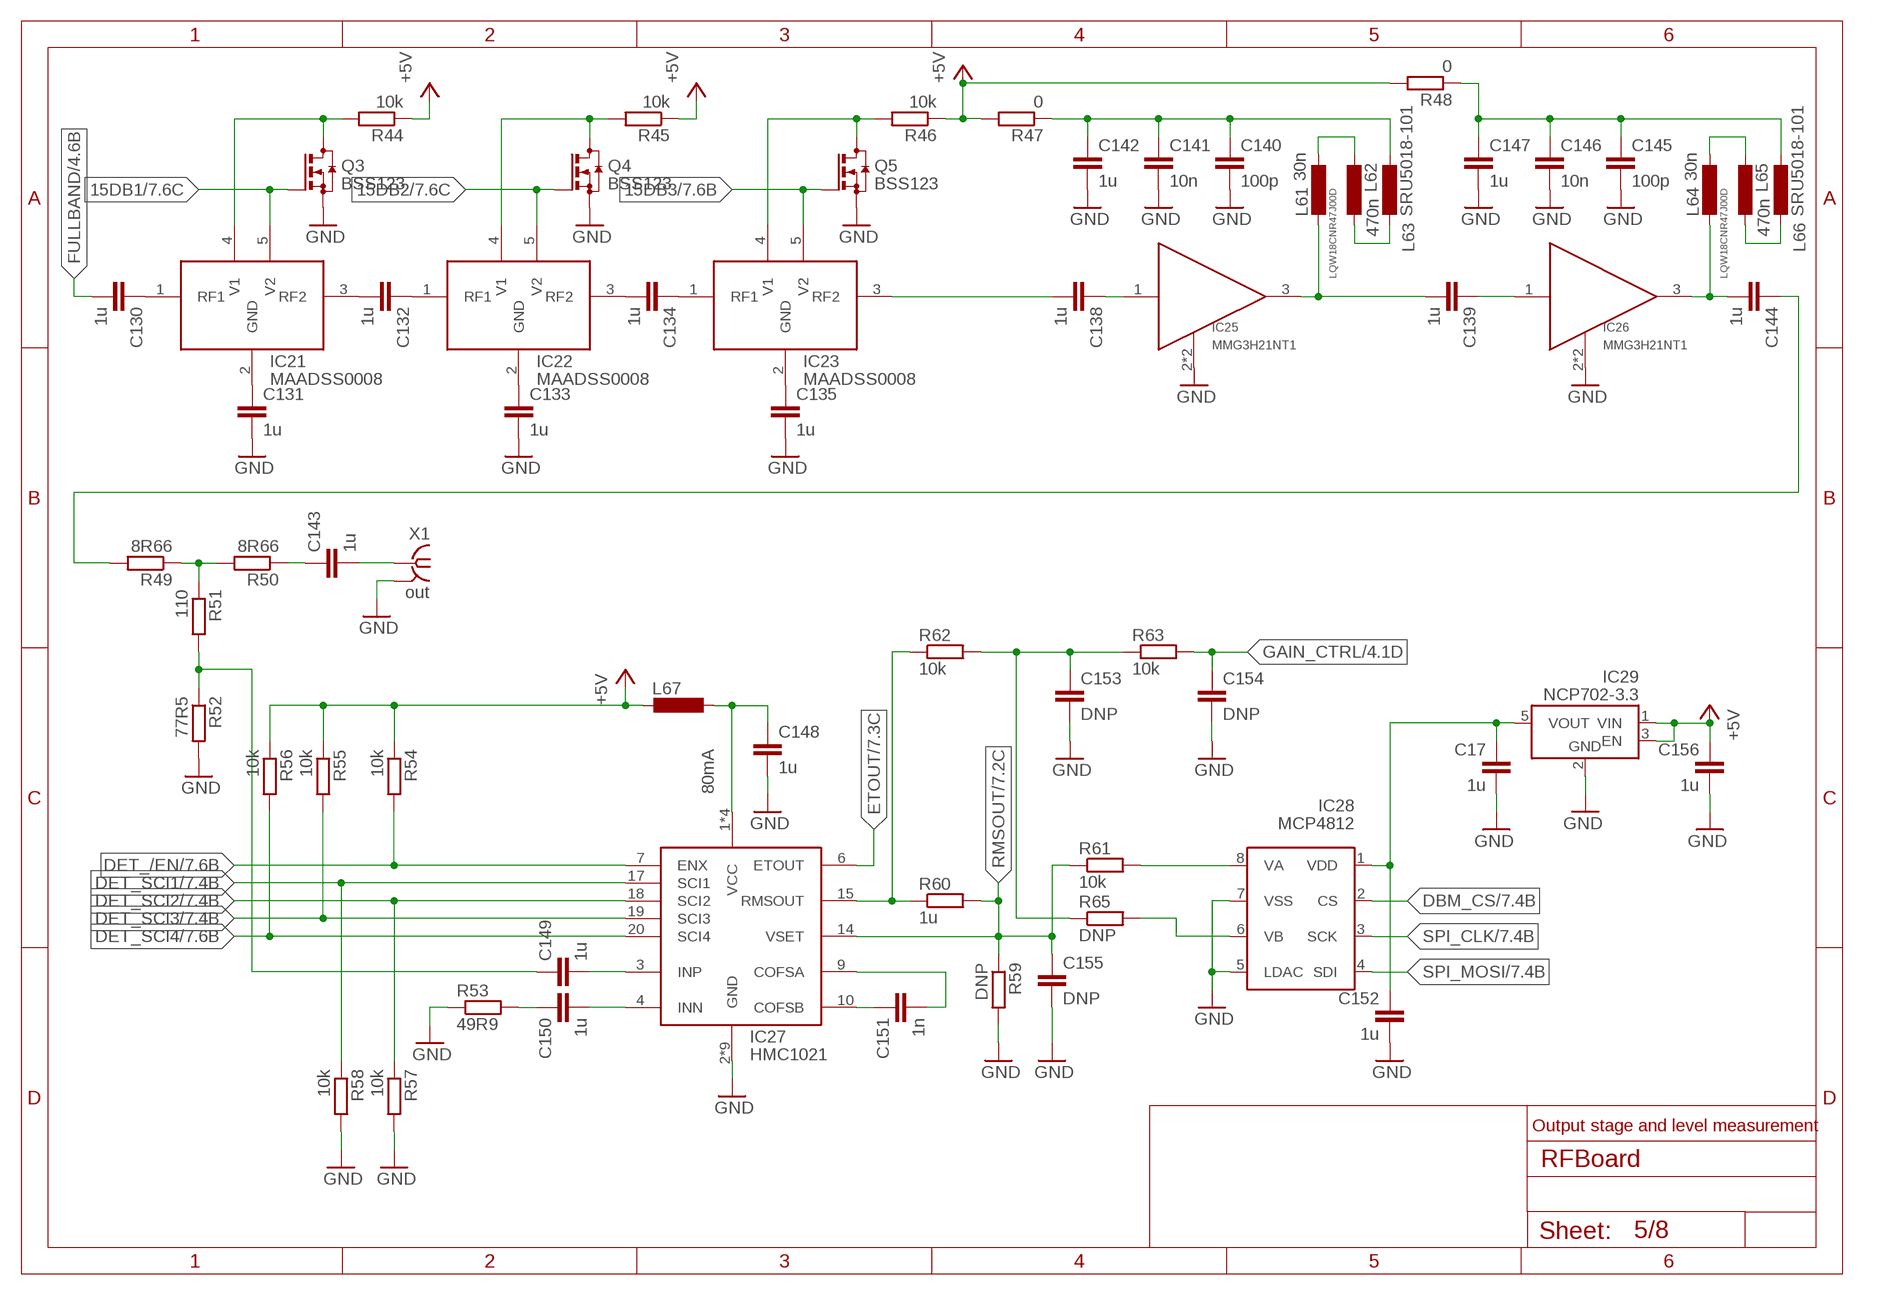
[diagram p4: schematic, sheet 5]

### Parts
C17  1u  C-EUC0603  [C0603]
C130  1u  C-EUC0603  [C0603]
C131  1u  C-EUC0603  [C0603]
C132  1u  C-EUC0603  [C0603]
C133  1u  C-EUC0603  [C0603]
C134  1u  C-EUC0603  [C0603]
C135  1u  C-EUC0603  [C0603]
C138  1u  C-EUC0603  [C0603]
C139  1u  C-EUC0603  [C0603]
C140  100p  C-EUC0603  [C0603]
C141  10n  C-EUC0603  [C0603]
C142  1u  C-EUC0603  [C0603]
C143  1u  C-EUC0603  [C0603]
C144  1u  C-EUC0603  [C0603]
C145  100p  C-EUC0603  [C0603]
C146  10n  C-EUC0603  [C0603]
C147  1u  C-EUC0603  [C0603]
C148  1u  C-EUC0603  [C0603]
C149  1u  C-EUC0603  [C0603]
C150  1u  C-EUC0603  [C0603]
C151  1n  C-EUC0603  [C0603]
C152  1u  C-EUC0603  [C0603]
C153  DNP  C-EUC0603  [C0603]
C154  DNP  C-EUC0603  [C0603]
C155  DNP  C-EUC0603  [C0603]
C156  1u  C-EUC0603  [C0603]
IC21  MAADSS0008  [SOT95P280X110-5]
IC22  MAADSS0008  [SOT95P280X110-5]
IC23  MAADSS0008  [SOT95P280X110-5]
IC25  MMG3H21NT1  HMC480  [SOT89]
IC26  MMG3H21NT1  HMC480  [SOT89]
IC27  HMC1021  [QFN50P400X400X100-25T270]
IC28  MCP4812  [SO08]
IC29  NCP702-3.3  NCP702  [SOT95P240X110-5]
L61  30n  INDUCTOR0603  [R0603]
L62  470n  INDUCTOR0603  [R0603]
L63  SRU5018-101  INDUCTOR5018  [SMD5018]
L64  30n  INDUCTOR0603  [R0603]
L65  470n  INDUCTOR0603  [R0603]
L66  SRU5018-101  INDUCTOR5018  [SMD5018]
L67  L-EUL2012C  [L2012C]
Q3  BSS123  [SOT23]
Q4  BSS123  [SOT23]
Q5  BSS123  [SOT23]
R44  10k  R-EU_R0603  [R0603]
R45  10k  R-EU_R0603  [R0603]
R46  10k  R-EU_R0603  [R0603]
R47  0  R-EU_R0603  [R0603]
R48  0  R-EU_R0603  [R0603]
R49  8R66  R-EU_R0603  [R0603]
R50  8R66  R-EU_R0603  [R0603]
R51  110  R-EU_R0603  [R0603]
R52  77R5  R-EU_R0603  [R0603]
R53  49R9  R-EU_R0603  [R0603]
R54  10k  R-EU_R0603  [R0603]
R55  10k  R-EU_R0603  [R0603]
R56  10k  R-EU_R0603  [R0603]
R57  10k  R-EU_R0603  [R0603]
R58  10k  R-EU_R0603  [R0603]
R59  DNP  R-EU_R0603  [R0603]
R60  1u  R-EU_R0603  [R0603]
R61  10k  R-EU_R0603  [R0603]
R62  10k  R-EU_R0603  [R0603]
R63  10k  R-EU_R0603  [R0603]
R65  DNP  R-EU_R0603  [R0603]
X1  out  SMA_CONNECTOR  [J502-ND-142-0711-821/826]

### Nets
15DB1: IC21.5(V2) Q3.1(G) ; also sheet 7
15DB2: IC22.5(V2) Q4.1(G) ; also sheet 7
15DB3: IC23.5(V2) Q5.1(G) ; also sheet 7
+5V: C156.1 IC29.1(VIN) IC29.3(EN) L67.2 R44.1 R45.1 R46.1 R47.2 R48.2 R54.1 R55.1 R56.1 ; also sheet 1,2,3,4,6,7
DBM_CS: IC28.2(CS) ; also sheet 7
DET_/EN: IC27.7(ENX) R54.2 ; also sheet 7
DET_SCI1: IC27.17(SCI1) R58.1 ; also sheet 7
DET_SCI2: IC27.18(SCI2) R57.1 ; also sheet 7
DET_SCI3: IC27.19(SCI3) R55.2 ; also sheet 7
DET_SCI4: IC27.20(SCI4) R56.2 ; also sheet 7
ETOUT: IC27.6(ETOUT) ; also sheet 7
FULLBAND: C130.2 ; also sheet 4
GAIN_CTRL: C154.1 R63.2 ; also sheet 4
GND: C17.2 C131.2 C133.2 C135.2 C140.2 C141.2 C142.2 C145.2 C146.2 C147.2 C148.2 C152.2 C153.2 C154.2 C155.2 C156.2 IC25.2(GND) IC25.2@1(GND) IC26.2(GND) IC26.2@1(GND) IC27.2(GND) IC27.5(GND) IC27.8(GND) IC27.11(GND) IC27.12(GND) IC27.13(GND) IC27.22(GND) IC27.24(GND) IC27.25(GND) IC28.5(LDAC) IC28.7(VSS) IC29.2(GND) Q3.2(S) Q4.2(S) Q5.2(S) R52.2 R53.1 R57.2 R58.2 R59.2 X1.G@1 X1.G@2 X1.G@3 X1.G@4 ; also sheet 1,2,3,4,6,7,8
N$105: IC28.8(VA) R61.2
N$106: IC28.6(VB) R65.2
N$124: C131.1 IC21.2(GND)
N$125: C130.1 IC21.1(RF1)
N$126: C132.1 IC22.1(RF1)
N$127: IC21.4(V1) Q3.3(D) R44.2
N$128: C133.1 IC22.2(GND)
N$129: IC22.4(V1) Q4.3(D) R45.2
N$130: C134.1 IC23.1(RF1)
N$131: C135.1 IC23.2(GND)
N$132: IC23.4(V1) Q5.3(D) R46.2
N$133: C134.2 IC22.3(RF2)
N$134: C132.2 IC21.3(RF2)
N$138: C139.2 IC25.3(OUT) L61.2
N$139: C138.1 IC25.1(IN)
N$140: L61.1 L62.2
N$141: L62.1 L63.P$3
N$142: C144.2 IC26.3(OUT) L64.2
N$143: C140.1 C141.1 C142.1 L63.P$1 R47.1
N$144: C139.1 IC26.1(IN)
N$145: C145.1 C146.1 C147.1 L66.P$1 R48.1
N$146: L64.1 L65.2
N$147: L65.1 L66.P$3
N$148: C138.2 IC23.3(RF2)
N$149: C144.1 R49.2
N$150: R49.1 R50.2 R51.1
N$151: C143.1 R50.1
N$152: C149.1 R51.2 R52.1
N$153: C143.2 X1.1
N$154: C148.1 IC27.1(VCC) IC27.16(VCC) IC27.21(VCC) IC27.23(VCC) L67.1
N$155: C149.2 IC27.3(INP)
N$156: C150.2 IC27.4(INN)
N$158: C153.1 R62.2 R63.1 R65.1
N$159: C150.1 R53.2
N$160: C151.1 IC27.10(COFSB)
N$161: C151.2 IC27.9(COFSA)
N$163: IC27.15(RMSOUT) R60.1 R62.1
RMSOUT: C155.1 IC27.14(VSET) R59.1 R60.2 R61.1 ; also sheet 7
SETDAC_VCC: C17.1 C152.1 IC28.1(VDD) IC29.5(VOUT)
SPI_CLK: IC28.3(SCK) ; also sheet 1,2,4,7
SPI_MOSI: IC28.4(SDI) ; also sheet 1,2,4,7

### Notes on the sheet
- LQW18CNR47J00D | LQW18CNR47J00D
- 80mA
- Output stage and level measurement

## Sheet 6 of 8
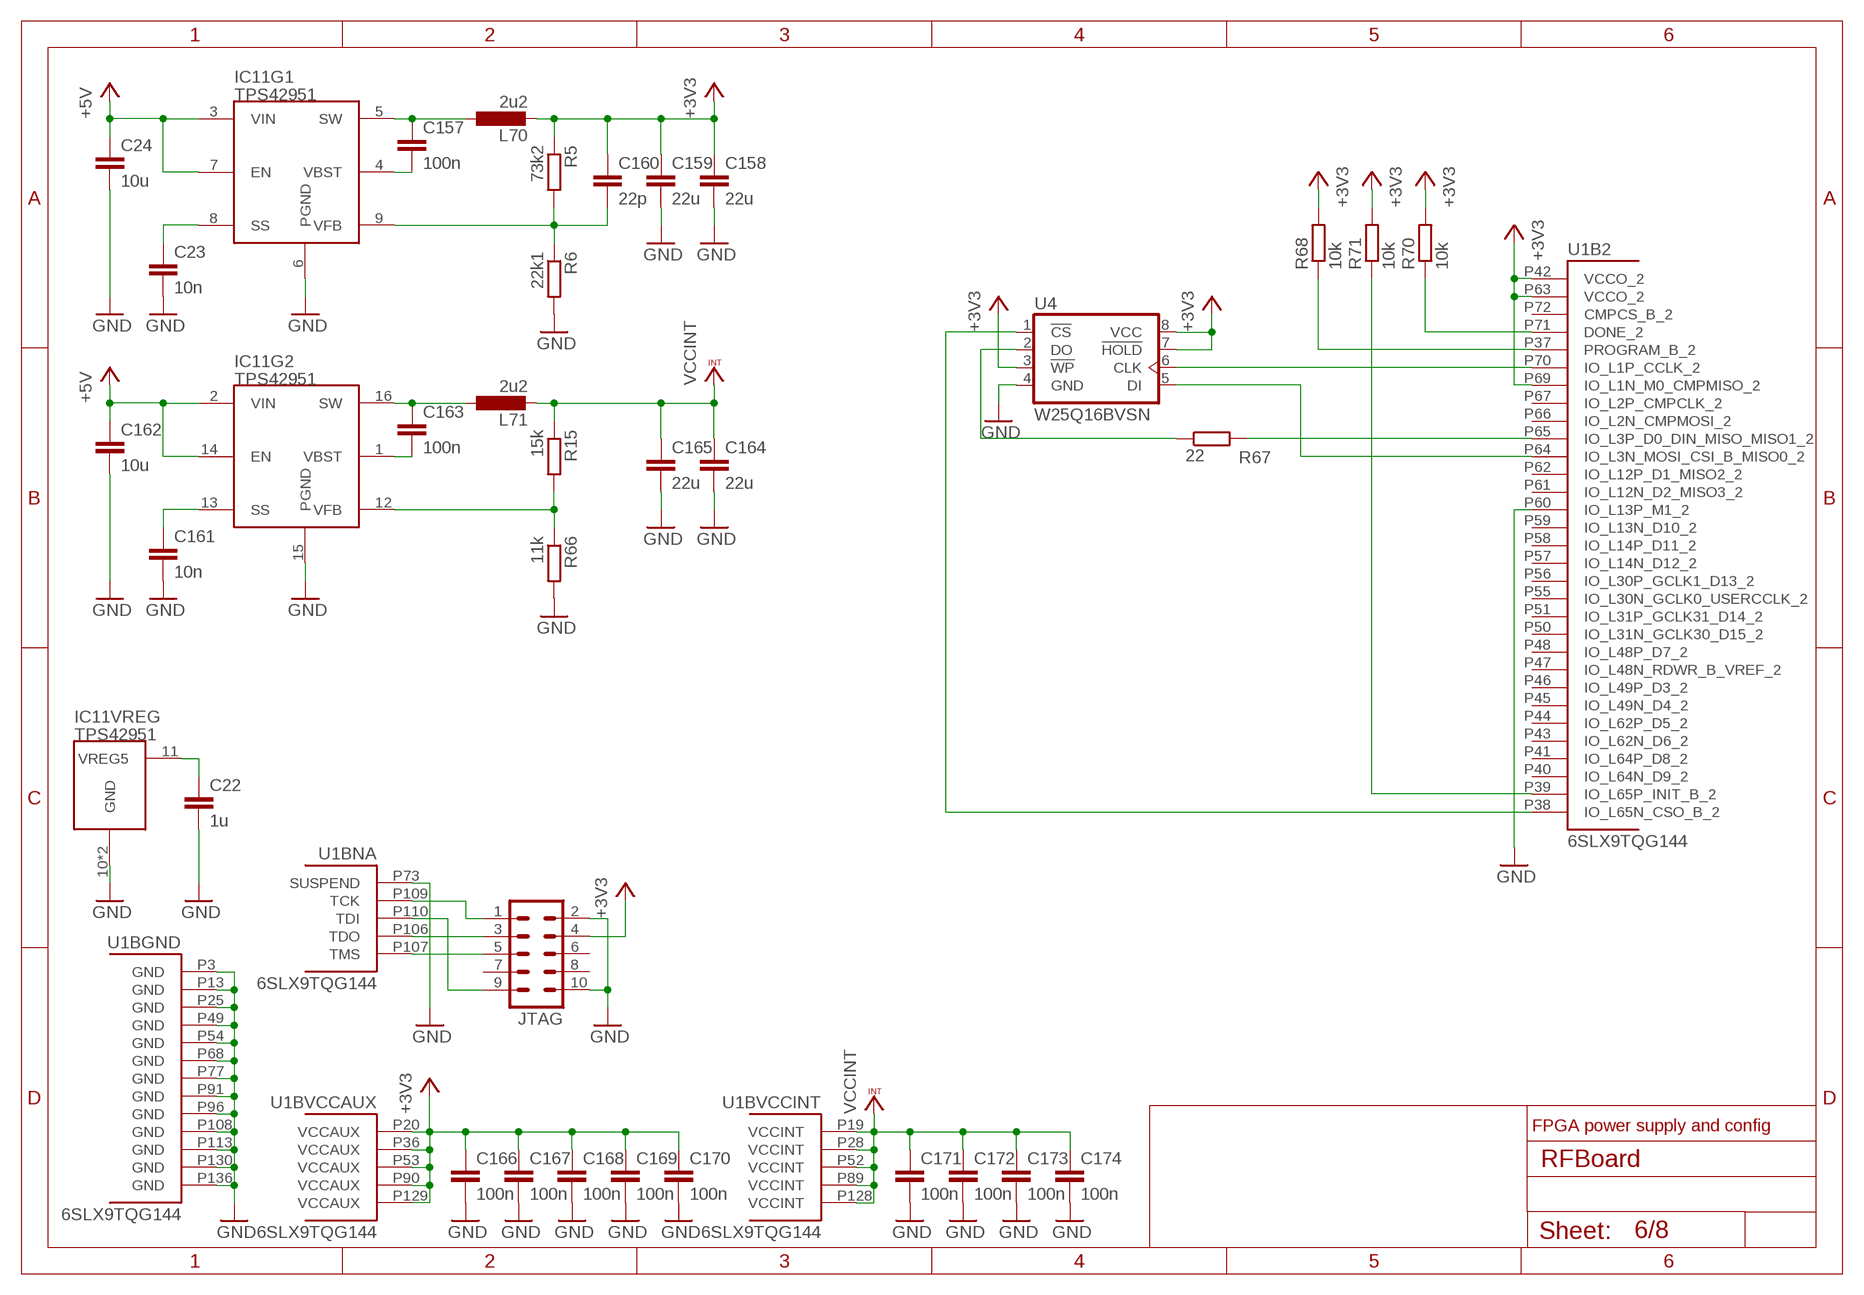
[diagram p5: schematic, sheet 6]

### Parts
C22  1u  C-EUC0603  [C0603]
C23  10n  C-EUC0603  [C0603]
C24  10u  C-EUC1206  [C1206]
C157  100n  C-EUC0603  [C0603]
C158  22u  C-EUC1206  [C1206]
C159  22u  C-EUC1206  [C1206]
C160  22p  C-EUC0603  [C0603]
C161  10n  C-EUC0603  [C0603]
C162  10u  C-EUC1206  [C1206]
C163  100n  C-EUC0603  [C0603]
C164  22u  C-EUC1206  [C1206]
C165  22u  C-EUC1206  [C1206]
C166  100n  C-EUC0603  [C0603]
C167  100n  C-EUC0603  [C0603]
C168  100n  C-EUC0603  [C0603]
C169  100n  C-EUC0603  [C0603]
C170  100n  C-EUC0603  [C0603]
C171  100n  C-EUC0603  [C0603]
C172  100n  C-EUC0603  [C0603]
C173  100n  C-EUC0603  [C0603]
C174  100n  C-EUC0603  [C0603]
IC11  TPS42951  [QFN65P400X400X100-17T270]
JTAG  ML10  [ML10]
L70  2u2  SRN5040  [SRN5040]
L71  2u2  SRN5040  [SRN5040]
R5  73k2  R-EU_R0603  [R0603]
R6  22k1  R-EU_R0603  [R0603]
R15  15k  R-EU_R0603  [R0603]
R66  11k  R-EU_R0603  [R0603]
R67  22  R-EU_R0603  [R0603]
R68  10k  R-EU_R0603  [R0603]
R70  10k  R-EU_R0603  [R0603]
R71  10k  R-EU_R0603  [R0603]
U1  6SLX9TQG144  [TQ144]
U4  W25Q16BVSN  [SO08]

### Nets
+3V3: C158.1 C159.1 C160.1 C166.1 C167.1 C168.1 C169.1 C170.1 JTAG.4 L70.P$2 R5.1 R68.2 R70.2 R71.2 U1.P20(BVCCAUX:VCCAUX) U1.P36(BVCCAUX:VCCAUX) U1.P42(B2:VCCO_2) U1.P53(BVCCAUX:VCCAUX) U1.P63(B2:VCCO_2) U1.P69(B2:IO_L1N_M0_CMPMISO_2) U1.P90(BVCCAUX:VCCAUX) U1.P129(BVCCAUX:VCCAUX) U4.3(!WP!) U4.7(!HOLD!) U4.8(VCC) ; also sheet 7,8
+5V: C24.1 C162.1 IC11.2(VIN) IC11.3(VIN) IC11.7(EN) IC11.14(EN) ; also sheet 1,2,3,4,5,7
FLACH_MOSI: U1.P64(B2:IO_L3N_MOSI_CSI_B_MISO0_2) U4.5(DI)
FLASH_CLK: U1.P70(B2:IO_L1P_CCLK_2) U4.6(CLK)
FLASH_CS: U1.P38(B2:IO_L65N_CSO_B_2) U4.1(!CS!)
FLASH_MISO: R67.1 U4.2(DO)
GND: C22.2 C23.2 C24.2 C158.2 C159.2 C161.2 C162.2 C164.2 C165.2 C166.2 C167.2 C168.2 C169.2 C170.2 C171.2 C172.2 C173.2 C174.2 IC11.6(PGND) IC11.10(VREG:GND) IC11.15(PGND) IC11.17(VREG:GND) JTAG.2 JTAG.10 R6.2 R66.2 U1.P3(BGND:GND) U1.P13(BGND:GND) U1.P25(BGND:GND) U1.P49(BGND:GND) U1.P54(BGND:GND) U1.P60(B2:IO_L13P_M1_2) U1.P68(BGND:GND) U1.P73(BNA:SUSPEND) U1.P77(BGND:GND) U1.P91(BGND:GND) U1.P96(BGND:GND) U1.P108(BGND:GND) U1.P113(BGND:GND) U1.P130(BGND:GND) U1.P136(BGND:GND) U4.4(GND) ; also sheet 1,2,3,4,5,7,8
N$19: JTAG.3 U1.P106(BNA:TDO)
N$21: JTAG.5 U1.P107(BNA:TMS)
N$24: JTAG.9 U1.P110(BNA:TDI)
N$89: JTAG.1 U1.P109(BNA:TCK)
N$165: C22.1 IC11.11(VREG:VREG5)
N$166: C23.1 IC11.8(SS)
N$167: C160.2 IC11.9(VFB) R5.2 R6.1
N$168: C161.1 IC11.13(SS)
N$169: C157.1 IC11.5(SW) L70.P$1
N$170: C157.2 IC11.4(VBST)
N$171: IC11.12(VFB) R15.2 R66.1
N$172: C163.1 IC11.16(SW) L71.P$1
N$173: C163.2 IC11.1(VBST)
N$174: R67.2 U1.P65(B2:IO_L3P_D0_DIN_MISO_MISO1_2)
N$175: R70.1 U1.P71(B2:DONE_2)
N$176: R68.1 U1.P37(B2:PROGRAM_B_2)
N$177: R71.1 U1.P39(B2:IO_L65P_INIT_B_2)
VCCINT: C164.1 C165.1 C171.1 C172.1 C173.1 C174.1 L71.P$2 R15.1 U1.P19(BVCCINT:VCCINT) U1.P28(BVCCINT:VCCINT) U1.P52(BVCCINT:VCCINT) U1.P89(BVCCINT:VCCINT) U1.P128(BVCCINT:VCCINT) ; also sheet 8
Unconnected: JTAG.6 JTAG.7 JTAG.8 U1.P40(B2:IO_L64N_D9_2) U1.P41(B2:IO_L64P_D8_2) U1.P43(B2:IO_L62N_D6_2) U1.P44(B2:IO_L62P_D5_2) U1.P45(B2:IO_L49N_D4_2) U1.P46(B2:IO_L49P_D3_2) U1.P47(B2:IO_L48N_RDWR_B_VREF_2) U1.P48(B2:IO_L48P_D7_2) U1.P50(B2:IO_L31N_GCLK30_D15_2) U1.P51(B2:IO_L31P_GCLK31_D14_2) U1.P55(B2:IO_L30N_GCLK0_USERCCLK_2) U1.P56(B2:IO_L30P_GCLK1_D13_2) U1.P57(B2:IO_L14N_D12_2) U1.P58(B2:IO_L14P_D11_2) U1.P59(B2:IO_L13N_D10_2) U1.P61(B2:IO_L12N_D2_MISO3_2) U1.P62(B2:IO_L12P_D1_MISO2_2) U1.P66(B2:IO_L2N_CMPMOSI_2) U1.P67(B2:IO_L2P_CMPCLK_2) U1.P72(B2:CMPCS_B_2)

### Notes on the sheet
- FPGA power supply and config

## Sheet 7 of 8
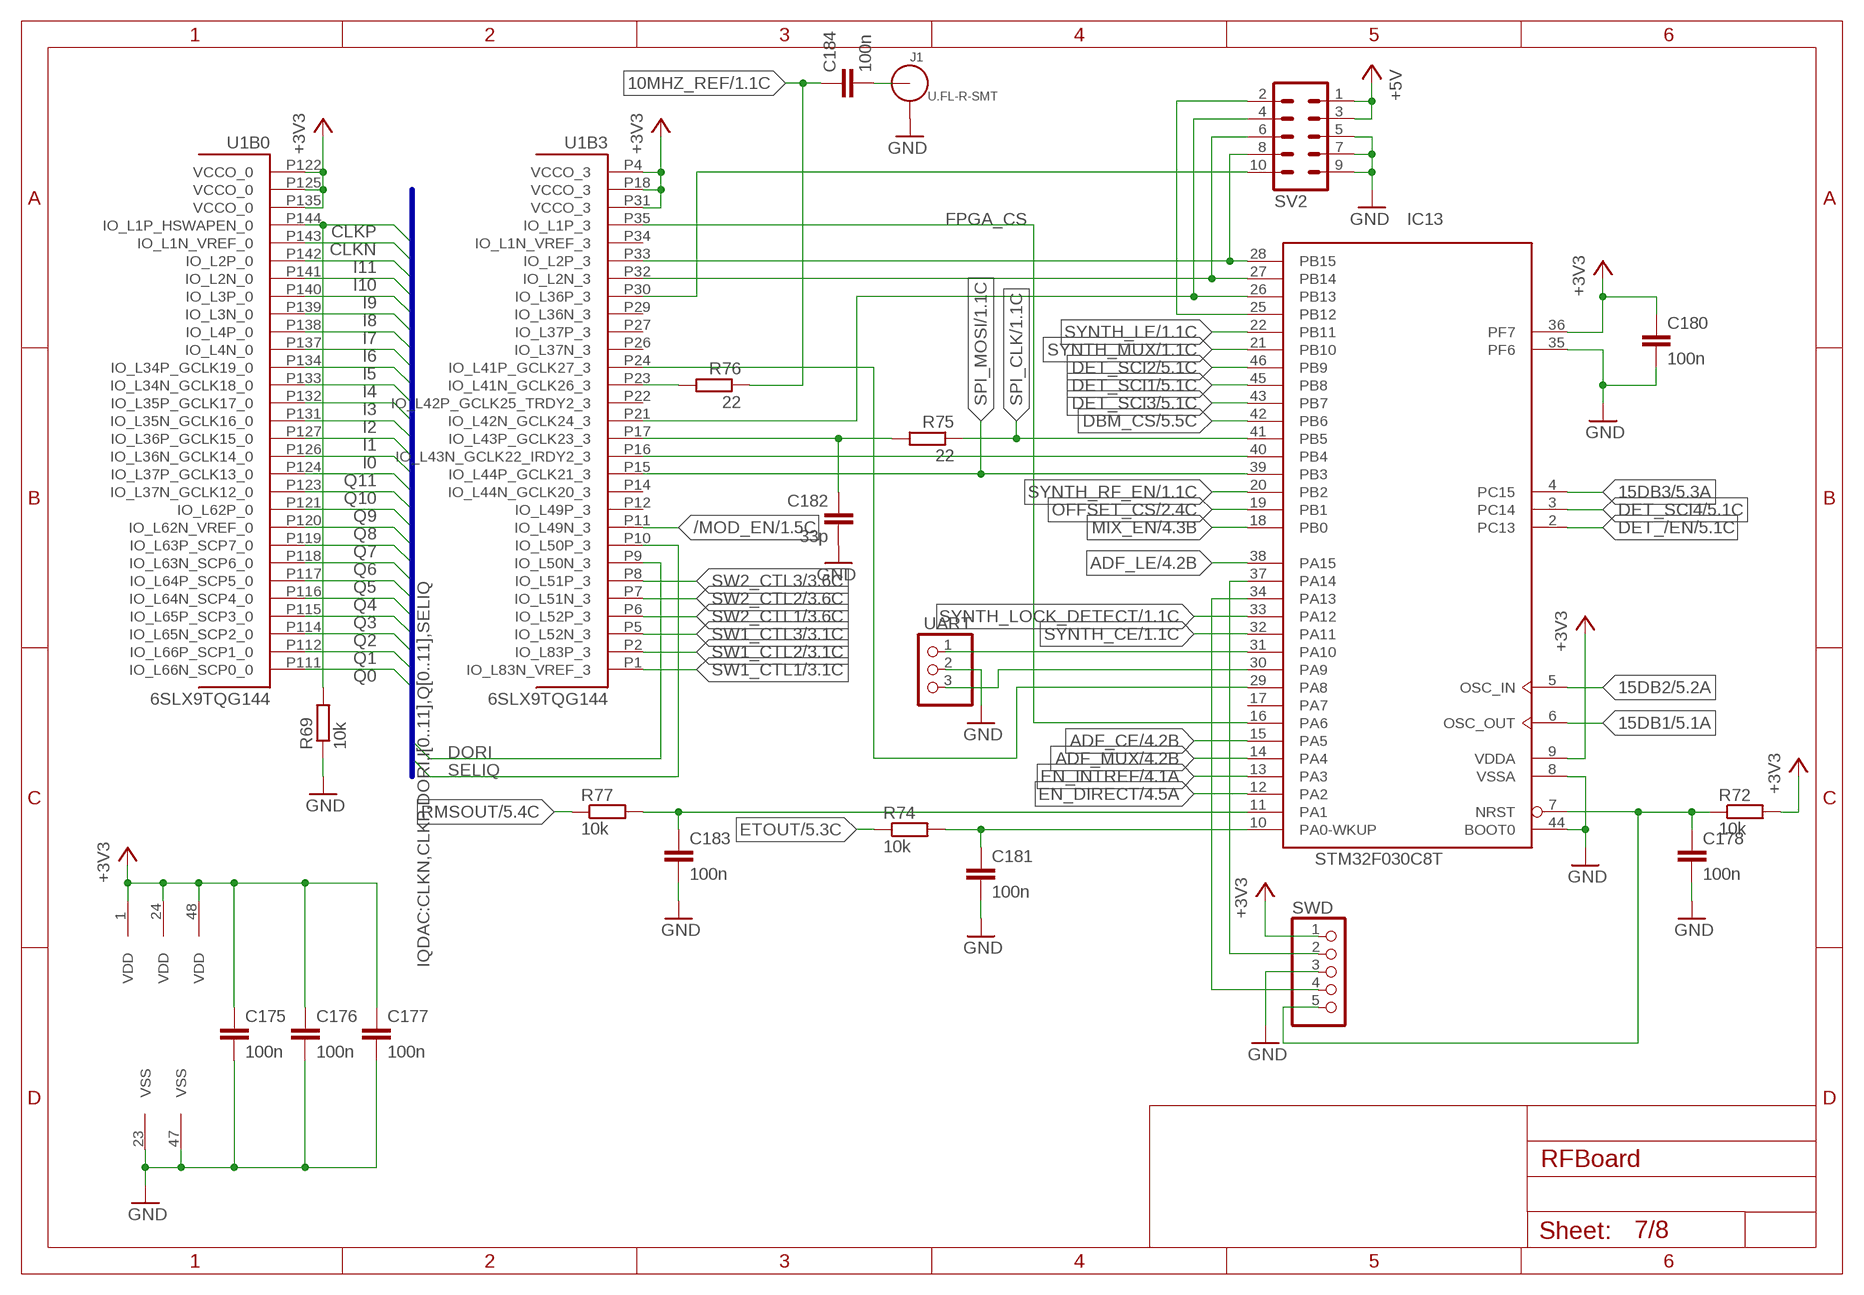
[diagram p6: schematic, sheet 7]

### Parts
C175  100n  C-EUC0603  [C0603]
C176  100n  C-EUC0603  [C0603]
C177  100n  C-EUC0603  [C0603]
C178  100n  C-EUC0603  [C0603]
C180  100n  C-EUC0603  [C0603]
C181  100n  C-EUC0603  [C0603]
C182  33p  C-EUC0603  [C0603]
C183  100n  C-EUC0603  [C0603]
C184  100n  C-EUC0603  [C0603]
IC13  STM32F030C8T  [LQFP48]
J1  U.FL-R-SMT  [U.FL_SMT]
R69  10k  R-EU_R0603  [R0603]
R72  10k  R-EU_R0603  [R0603]
R74  10k  R-EU_R0603  [R0603]
R75  22  R-EU_R0603  [R0603]
R76  22  R-EU_R0603  [R0603]
R77  10k  R-EU_R0603  [R0603]
SV2  ML10  [ML10]
SWD  PINHD-1X5  [1X05]
UART  PINHD-1X3  [1X03]

### Nets
10MHZ_REF: C184.1 R76.1 ; also sheet 1,4
15DB1: IC13.6(OSC_OUT) ; also sheet 5
15DB2: IC13.5(OSC_IN) ; also sheet 5
15DB3: IC13.4(PC15) ; also sheet 5
+3V3: C175.1 C176.1 C177.1 C180.1 IC13.1(VDD) IC13.9(VDDA) IC13.24(VDD) IC13.36(PF7) IC13.48(VDD) R72.2 SWD.1 U1.P4(B3:VCCO_3) U1.P18(B3:VCCO_3) U1.P31(B3:VCCO_3) U1.P122(B0:VCCO_0) U1.P125(B0:VCCO_0) U1.P135(B0:VCCO_0) ; also sheet 6,8
+5V: SV2.1 SV2.3 ; also sheet 1,2,3,4,5,6
/MOD_EN: U1.P11(B3:IO_L49N_3) ; also sheet 1
ADF_CE: IC13.15(PA5) ; also sheet 4
ADF_LE: IC13.38(PA15) ; also sheet 4
ADF_MUX: IC13.14(PA4) ; also sheet 4
CLKN: U1.P143(B0:IO_L1N_VREF_0) ; also sheet 2
CLKP: R69.2 U1.P144(B0:IO_L1P_HSWAPEN_0) ; also sheet 2
CS: IC13.25(PB12) SV2.2
CS_FPGA: SV2.10 U1.P30(B3:IO_L36P_3)
DBM_CS: IC13.42(PB6) ; also sheet 5
DET_/EN: IC13.2(PC13) ; also sheet 5
DET_SCI1: IC13.45(PB8) ; also sheet 5
DET_SCI2: IC13.46(PB9) ; also sheet 5
DET_SCI3: IC13.43(PB7) ; also sheet 5
DET_SCI4: IC13.3(PC14) ; also sheet 5
DORI: U1.P9(B3:IO_L50N_3) ; also sheet 2
EN_DIRECT: IC13.12(PA2) ; also sheet 4
EN_INTREF: IC13.13(PA3) ; also sheet 4
ETOUT: R74.1 ; also sheet 5
FPGA_CS: IC13.16(PA6) U1.P35(B3:IO_L1P_3)
GND: C175.2 C176.2 C177.2 C178.2 C180.2 C181.2 C182.2 C183.2 IC13.8(VSSA) IC13.23(VSS) IC13.35(PF6) IC13.44(BOOT0) IC13.47(VSS) J1.GND1 J1.GND2 R69.1 SV2.5 SV2.7 SV2.9 SWD.3 UART.2 ; also sheet 1,2,3,4,5,6,8
I0: U1.P126(B0:IO_L36N_GCLK14_0) ; also sheet 2
I1: U1.P127(B0:IO_L36P_GCLK15_0) ; also sheet 2
I2: U1.P131(B0:IO_L35N_GCLK16_0) ; also sheet 2
I3: U1.P132(B0:IO_L35P_GCLK17_0) ; also sheet 2
I4: U1.P133(B0:IO_L34N_GCLK18_0) ; also sheet 2
I5: U1.P134(B0:IO_L34P_GCLK19_0) ; also sheet 2
I6: U1.P137(B0:IO_L4N_0) ; also sheet 2
I7: U1.P138(B0:IO_L4P_0) ; also sheet 2
I8: U1.P139(B0:IO_L3N_0) ; also sheet 2
I9: U1.P140(B0:IO_L3P_0) ; also sheet 2
I10: U1.P141(B0:IO_L2N_0) ; also sheet 2
I11: U1.P142(B0:IO_L2P_0) ; also sheet 2
MISO: IC13.27(PB14) SV2.6 U1.P32(B3:IO_L2N_3)
MIX_EN: IC13.18(PB0) ; also sheet 4
MOSI: IC13.28(PB15) SV2.8 U1.P33(B3:IO_L2P_3)
N$157: C183.1 IC13.11(PA1) R77.2
N$178: C184.2 J1.SIG(ANT)
N$184: IC13.29(PA8) U1.P24(B3:IO_L41P_GCLK27_3)
N$189: C181.1 IC13.10(PA0-WKUP) R74.2
N$190: C182.1 R75.2 U1.P17(B3:IO_L43P_GCLK23_3)
N$191: IC13.40(PB4) U1.P16(B3:IO_L43N_GCLK22_IRDY2_3)
N$192: R76.2 U1.P23(B3:IO_L41N_GCLK26_3)
NRST: C178.1 IC13.7(NRST) R72.1 SWD.5
OFFSET_CS: IC13.19(PB1) ; also sheet 2
Q0: U1.P111(B0:IO_L66N_SCP0_0) ; also sheet 2
Q1: U1.P112(B0:IO_L66P_SCP1_0) ; also sheet 2
Q2: U1.P114(B0:IO_L65N_SCP2_0) ; also sheet 2
Q3: U1.P115(B0:IO_L65P_SCP3_0) ; also sheet 2
Q4: U1.P116(B0:IO_L64N_SCP4_0) ; also sheet 2
Q5: U1.P117(B0:IO_L64P_SCP5_0) ; also sheet 2
Q6: U1.P118(B0:IO_L63N_SCP6_0) ; also sheet 2
Q7: U1.P119(B0:IO_L63P_SCP7_0) ; also sheet 2
Q8: U1.P120(B0:IO_L62N_VREF_0) ; also sheet 2
Q9: U1.P121(B0:IO_L62P_0) ; also sheet 2
Q10: U1.P123(B0:IO_L37N_GCLK12_0) ; also sheet 2
Q11: U1.P124(B0:IO_L37P_GCLK13_0) ; also sheet 2
RMSOUT: R77.1 ; also sheet 5
RX: IC13.31(PA10) UART.1
SCK: IC13.26(PB13) SV2.4 U1.P21(B3:IO_L42N_GCLK24_3)
SELIQ: U1.P10(B3:IO_L50P_3) ; also sheet 2
SPI_CLK: IC13.41(PB5) R75.1 ; also sheet 1,2,4,5
SPI_MOSI: IC13.39(PB3) U1.P15(B3:IO_L44P_GCLK21_3) ; also sheet 1,2,4,5
SW1_CTL1: U1.P1(B3:IO_L83N_VREF_3) ; also sheet 3
SW1_CTL2: U1.P2(B3:IO_L83P_3) ; also sheet 3
SW1_CTL3: U1.P5(B3:IO_L52N_3) ; also sheet 3
SW2_CTL1: U1.P6(B3:IO_L52P_3) ; also sheet 3
SW2_CTL2: U1.P7(B3:IO_L51N_3) ; also sheet 3
SW2_CTL3: U1.P8(B3:IO_L51P_3) ; also sheet 3
SWCLK: IC13.37(PA14) SWD.2
SWDIO: IC13.34(PA13) SWD.4
SYNTH_CE: IC13.32(PA11) ; also sheet 1
SYNTH_LE: IC13.22(PB11) ; also sheet 1
SYNTH_LOCK_DETECT: IC13.33(PA12) ; also sheet 1
SYNTH_MUX: IC13.21(PB10) ; also sheet 1
SYNTH_RF_EN: IC13.20(PB2) ; also sheet 1
TX: IC13.30(PA9) UART.3
Unconnected: IC13.17(PA7) U1.P12(B3:IO_L49P_3) U1.P14(B3:IO_L44N_GCLK20_3) U1.P22(B3:IO_L42P_GCLK25_TRDY2_3) U1.P26(B3:IO_L37N_3) U1.P27(B3:IO_L37P_3) U1.P29(B3:IO_L36N_3) U1.P34(B3:IO_L1N_VREF_3)

### Buses
IQDAC:CLKN,CLKP,DORI,I[0..11],Q[0..11],SELIQ

## Sheet 8 of 8
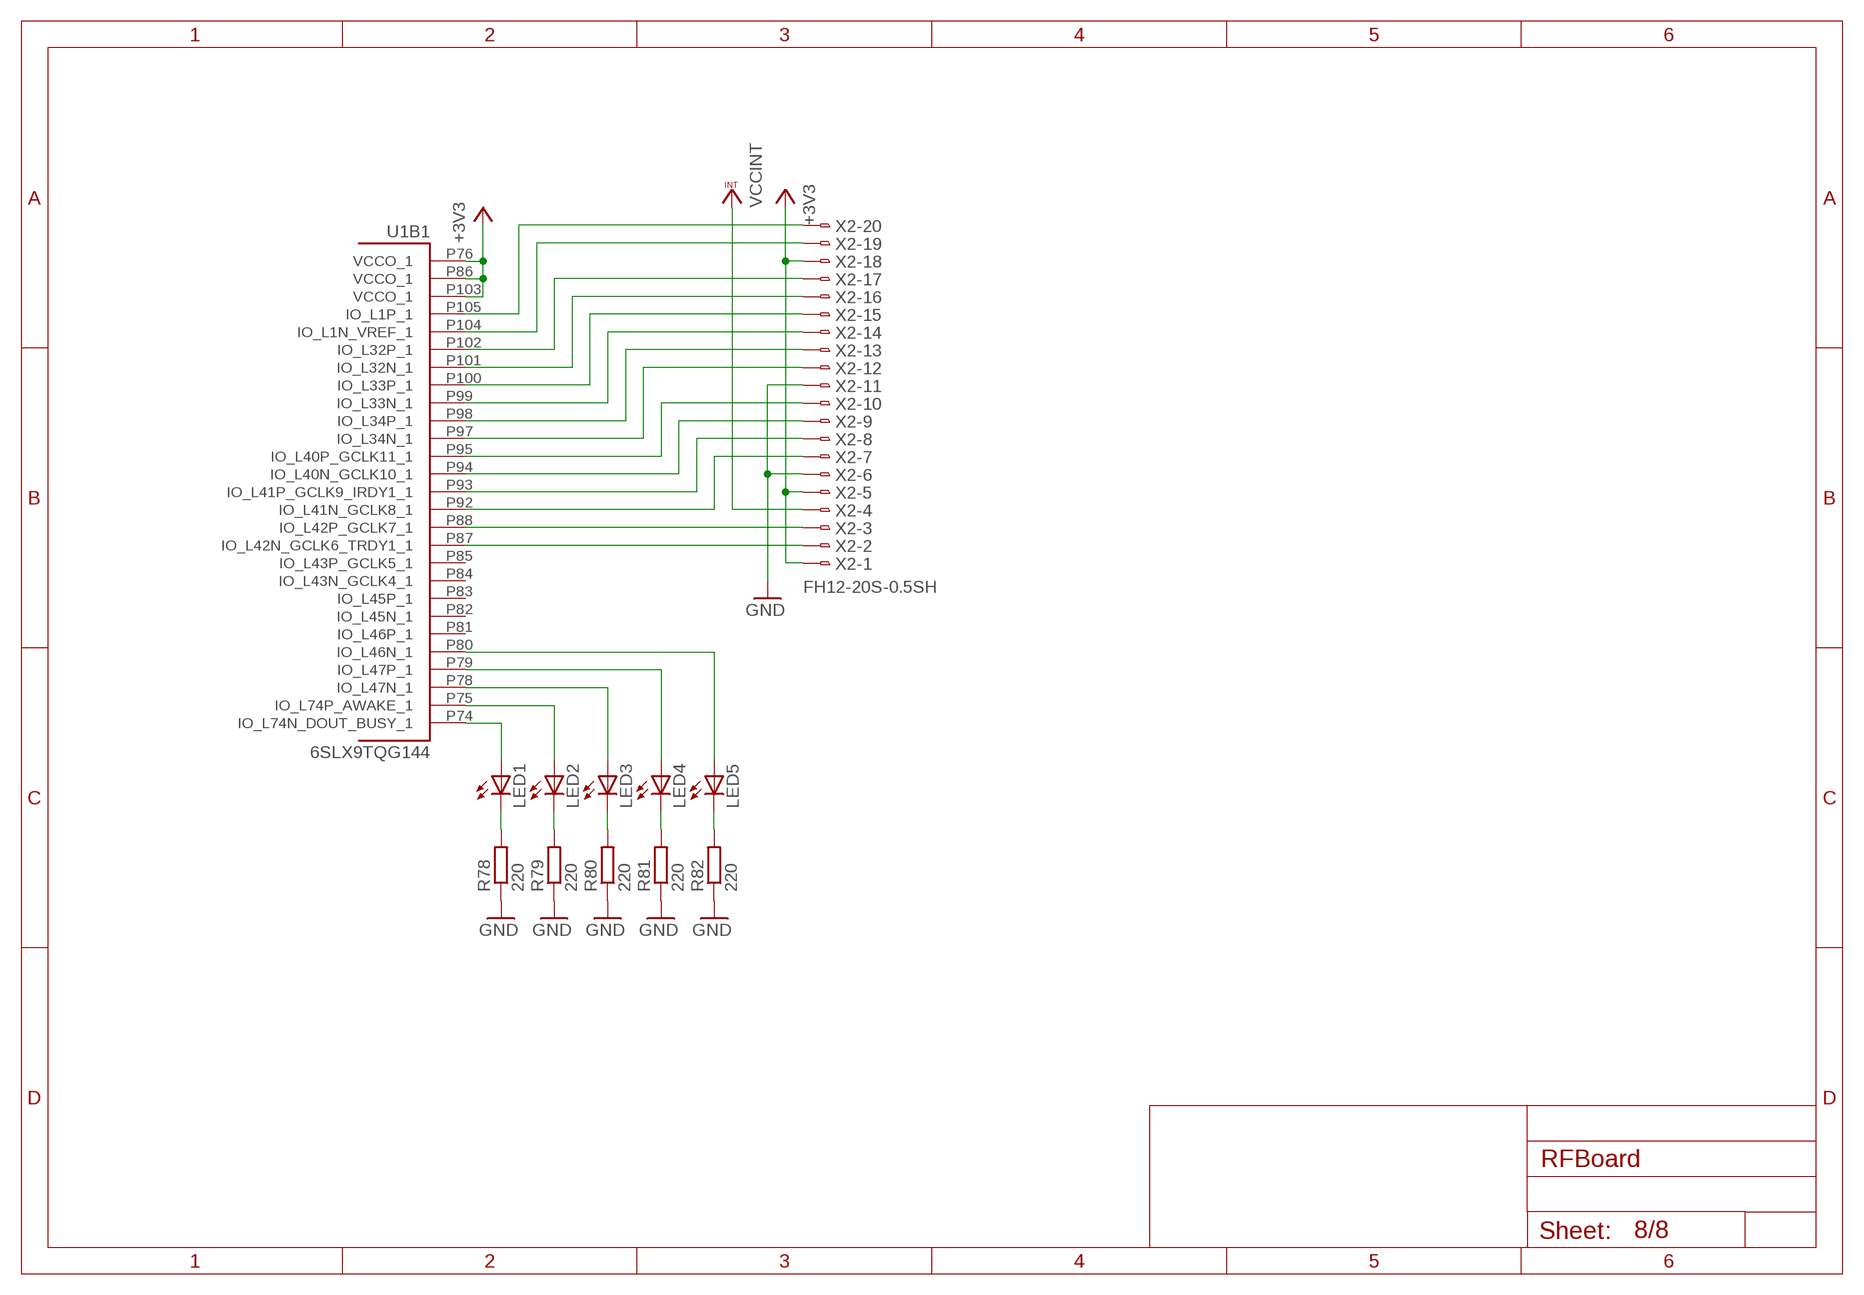
[diagram p7: schematic, sheet 8]

### Parts
LED1  LEDCHIP-LED0603  [CHIP-LED0603]
LED2  LEDCHIP-LED0603  [CHIP-LED0603]
LED3  LEDCHIP-LED0603  [CHIP-LED0603]
LED4  LEDCHIP-LED0603  [CHIP-LED0603]
LED5  LEDCHIP-LED0603  [CHIP-LED0603]
R78  220  R-EU_R0603  [R0603]
R79  220  R-EU_R0603  [R0603]
R80  220  R-EU_R0603  [R0603]
R81  220  R-EU_R0603  [R0603]
R82  220  R-EU_R0603  [R0603]
X2  FH12-20S-0.5SH  [FH12-20S-0.5SH]

### Nets
+3V3: U1.P76(B1:VCCO_1) U1.P86(B1:VCCO_1) U1.P103(B1:VCCO_1) X2.1 X2.5 X2.18 ; also sheet 6,7
GND: R78.1 R79.1 R80.1 R81.1 R82.1 X2.6 X2.11 ; also sheet 1,2,3,4,5,6,7
N$162: U1.P100(B1:IO_L33P_1) X2.15
N$193: U1.P87(B1:IO_L42N_GCLK6_TRDY1_1) X2.2
N$194: U1.P88(B1:IO_L42P_GCLK7_1) X2.3
N$195: U1.P92(B1:IO_L41N_GCLK8_1) X2.7
N$196: U1.P93(B1:IO_L41P_GCLK9_IRDY1_1) X2.8
N$197: U1.P94(B1:IO_L40N_GCLK10_1) X2.9
N$198: U1.P95(B1:IO_L40P_GCLK11_1) X2.10
N$199: U1.P97(B1:IO_L34N_1) X2.12
N$200: U1.P98(B1:IO_L34P_1) X2.13
N$201: U1.P99(B1:IO_L33N_1) X2.14
N$202: U1.P101(B1:IO_L32N_1) X2.16
N$203: U1.P102(B1:IO_L32P_1) X2.17
N$204: U1.P104(B1:IO_L1N_VREF_1) X2.19
N$205: U1.P105(B1:IO_L1P_1) X2.20
N$206: LED1.C R78.2
N$207: LED2.C R79.2
N$208: LED3.C R80.2
N$209: LED4.C R81.2
N$210: LED5.C R82.2
N$211: LED1.A U1.P74(B1:IO_L74N_DOUT_BUSY_1)
N$212: LED2.A U1.P75(B1:IO_L74P_AWAKE_1)
N$213: LED3.A U1.P78(B1:IO_L47N_1)
N$214: LED4.A U1.P79(B1:IO_L47P_1)
N$215: LED5.A U1.P80(B1:IO_L46N_1)
VCCINT: X2.4 ; also sheet 6
Unconnected: U1.P81(B1:IO_L46P_1) U1.P82(B1:IO_L45N_1) U1.P83(B1:IO_L45P_1) U1.P84(B1:IO_L43N_GCLK4_1) U1.P85(B1:IO_L43P_GCLK5_1)

## Library data of the parts
B1 = rf:HHM1522B1
C1-C60 C101-C184 = rcl:C-EU: CAPACITOR, European symbol
C61-C100 = resistor:C-EU: CAPACITOR, European symbol
IC1 = rf:HMC1097
IC2 = rf:MAX2871
IC3 = rf:AP2114
IC4 IC5 IC7-IC10 IC18 IC19 IC29 = rf:NCP702
IC6 = rf:MAX5873
IC11 = custom-ic:TPS42951
IC12 IC28 = dac:MCP48: 12-Bit Dual Voltage Output Digital-to-Analog Converter with Internal VREF and SPI Interface Datasheet: \dac-datasheets\MCP4822.pdf Features • MCP4802: Dual 8-Bit Voltage Output DAC • MCP4812: Dual 10-Bit Voltage Output DAC • MCP4822: Dual 12-Bit Voltage Output DAC • Rail-to-Rail Output • SPI Interface with 20 MHz Clock Support • Simultaneous Latching of the Dual DACs with LDAC pin • Fast Settling Time of 4.5 μs • Selectable Unity or 2x Gain Output • 2.048V Internal Voltage Reference • 50ppm/°C VREF Temperature Coefficient • 2.7V to 5.5V Single-Supply Operation • Extended Temperature Range: -40°C to +125°C Applications • Set Point or Offset Trimming • Sensor Calibration • Precision Selectable Voltage Reference • Portable Instrumentation (Battery-Powered) • Calibration of Optical Communication Devices Description The MCP4802/4812/4822 devices are dual 8-bit, 10-bit and 12-bit buffered voltage output Digital-to-Analog Converters (DACs), respectively. The devices operate from a single 2.7V to 5.5V supply with SPI compatible Serial Peripheral Interface. The devices have a high precision internal voltage reference (VREF = 2.048V). The user can configure the full-scale range of the device to be 2.048V or 4.096V by setting the Gain Selection Option bit (gain of 1 of 2). Each DAC channel can be operated in Active or Shutdown mode individually by setting the Configuration register bits. In Shutdown mode, most of the internal circuits in the shutdown channel are turned off for power savings and the output amplifier is configured to present a known high resistance output load (500 kOhm typical. The devices include double-buffered registers, allowing synchronous updates of two DAC outputs using the LDAC pin. These devices also incorporate a Power-on Reset (POR) circuit to ensure reliable powerup. The devices utilize a resistive string architecture, with its inherent advantages of low DNL error, low ratio metric temperature coefficient and fast settling time. These devices are specified over the extended temperature range (+125°C). The devices provide high accuracy and low noise performance for consumer and industrial applications where calibration or compensation of signals (such as temperature, pressure and humidity) are required. The MCP4802/4812/4822 devices are available in the PDIP, SOIC and MSOP packages.; MPN: MCP4822-E/SN; OC_FARNELL: 1834912; PACKAGE: SO08; SUPPLIER: MICROCHIP
IC13 = micro-stm_v3:STM32F030C*T: ARM 32-bit Cortex™-M0 CPU 48 MHz maximum frequency 32 to 64 Kbytes of Flash memory 4 to 8 kbytes of SRAM 39 GPIOs 2.4 to 3.6 V application supply
IC14 = rf:LT5560
IC15 = rf:ADF4360
IC16 IC17 = rf:HMC284
IC20 = linear:OPA*-SOT23: Single Operational Amplifier Low Power, Single-Supply, Rail-To-Rail Operational Amplifier Source: http://focus.ti.com/lit/ds/symlink/opa2345.pdf
IC21-IC23 = rf:MAADSS0008
IC24 = rf:RFSA2033
IC25 IC26 = rf:HMC480
IC27 = rf:HMC1021
IC31 IC32 = rf:QPC6064
J1 = connector:U.FL-R-SMT: U.FL-R-SMT Antenna Connector; DIGIKEY: H122041-ND; MANUFACTURER: Hirose; MPN: U.FL-R-SMT-1(01)
JTAG SV2 = con-ml:ML10: HARTING; OC_FARNELL: unknown; OC_NEWARK: unknown
L1 L2 L56 L57 L67-L69 = rcl:L-EU: INDUCTOR, European symbol
L3-L55 L58-L66 = rf:INDUCTOR
L70 L71 = custom-ic:SRN5040
LED1-LED5 = led:LED: LED OSRAM: - CHIPLED LG R971, LG N971, LY N971, LG Q971, LY Q971, LO R971, LY R971 LH N974, LH R974 LS Q976, LO Q976, LY Q976 LO Q996 - Hyper CHIPLED LW Q18S LB Q993, LB Q99A, LB R99A - SideLED LS A670, LO A670, LY A670, LG A670, LP A670 LB A673, LV A673, LT A673, LW A673 LH A674 LY A675 LS A676, LA A676, LO A676, LY A676, LW A676 LS A679, LY A679, LG A679 - Hyper Micro SIDELED® LS Y876, LA Y876, LO Y876, LY Y876 LT Y87S - SmartLED LW L88C, LW L88S LB L89C, LB L89S, LG L890 LS L89K, LO L89K, LY L89K LS L896, LA L896, LO L896, LY L896 - TOPLED LS T670, LO T670, LY T670, LG T670, LP T670 LSG T670, LSP T670, LSY T670, LOP T670, LYG T670 LG T671, LOG T671, LSG T671 LB T673, LV T673, LT T673, LW T673 LH T674 LS T676, LA T676, LO T676, LY T676, LB T676, LH T676, LSB T676, LW T676 LB T67C, LV T67C, LT T67C, LS T67K, LO T67K, LY T67K, LW E67C LS E67B, LA E67B, LO E67B, LY E67B, LB E67C, LV E67C, LT E67C LW T67C LS T679, LY T679, LG T679 LS T770, LO T770, LY T770, LG T770, LP T770 LB T773, LV T773, LT T773, LW T773 LH T774 LS E675, LA E675, LY E675, LS T675 LS T776, LA T776, LO T776, LY T776, LB T776 LHGB T686 LT T68C, LB T68C - Hyper Mini TOPLED® LB M676 - Mini TOPLED Santana® LG M470 LS M47K, LO M47K, LY M47K Source: http://www.osram.convergy.de LUXEON: - LUMILED® LXK2-PW12-R00, LXK2-PW12-S00, LXK2-PW14-U00, LXK2-PW14-V00 LXK2-PM12-R00, LXK2-PM12-S00, LXK2-PM14-U00 LXK2-PE12-Q00, LXK2-PE12-R00, LXK2-PE12-S00, LXK2-PE14-T00, LXK2-PE14-U00 LXK2-PB12-K00, LXK2-PB12-L00, LXK2-PB12-M00, LXK2-PB14-N00, LXK2-PB14-P00, LXK2-PB14-Q00 LXK2-PR12-L00, LXK2-PR12-M00, LXK2-PR14-Q00, LXK2-PR14-R00 LXK2-PD12-Q00, LXK2-PD12-R00, LXK2-PD12-S00 LXK2-PH12-R00, LXK2-PH12-S00 LXK2-PL12-P00, LXK2-PL12-Q00, LXK2-PL12-R00 Source: www.luxeon.com KINGBRIGHT: KA-3528ASYC Source: www.kingbright.com
Q1-Q5 = transistor-small-signal:BSS123: N-CHANNEL MOS FET
Q6 = transistor-small-signal:BSS84: P-CHANNEL MOS FET
R1-R16 R27 R29-R42 R44-R52 R54-R82 = resistor:R-EU_: RESISTOR, European symbol
R17-R26 R28 R43 R53 = rcl:R-EU_: RESISTOR, European symbol
SWD = pinhead:PINHD-1X5: PIN HEADER
TC1 = IQD-Frequency-Products:TCXO-NO-VC: CRYSTAL RESONATOR
U1 = xilinx_devices_V6:6SLX9TQG144: Xilinx FPGA: 6SLX9TQG144
U4 = memory-winbond:W25Q16BV: EEPROM 4 Mbit SPI Serial Flash7
UART = pinhead:PINHD-1X3: PIN HEADER
X1 = rf:SMA_CONNECTOR
X2 = con-hirose:FH12-20S-0.5S: 0.5mm Pitch Connectors For FPC/FFC Source: Data sheet <http://www.hirose.co.jp/cataloge_hp/e58605370.pdf>; MPN: FH12-20S-0.5SH(55); OC_FARNELL: 1324549; OC_NEWARK: 34M6166